# Altium project MainBoard.PrjPCB (part 1 of 2)
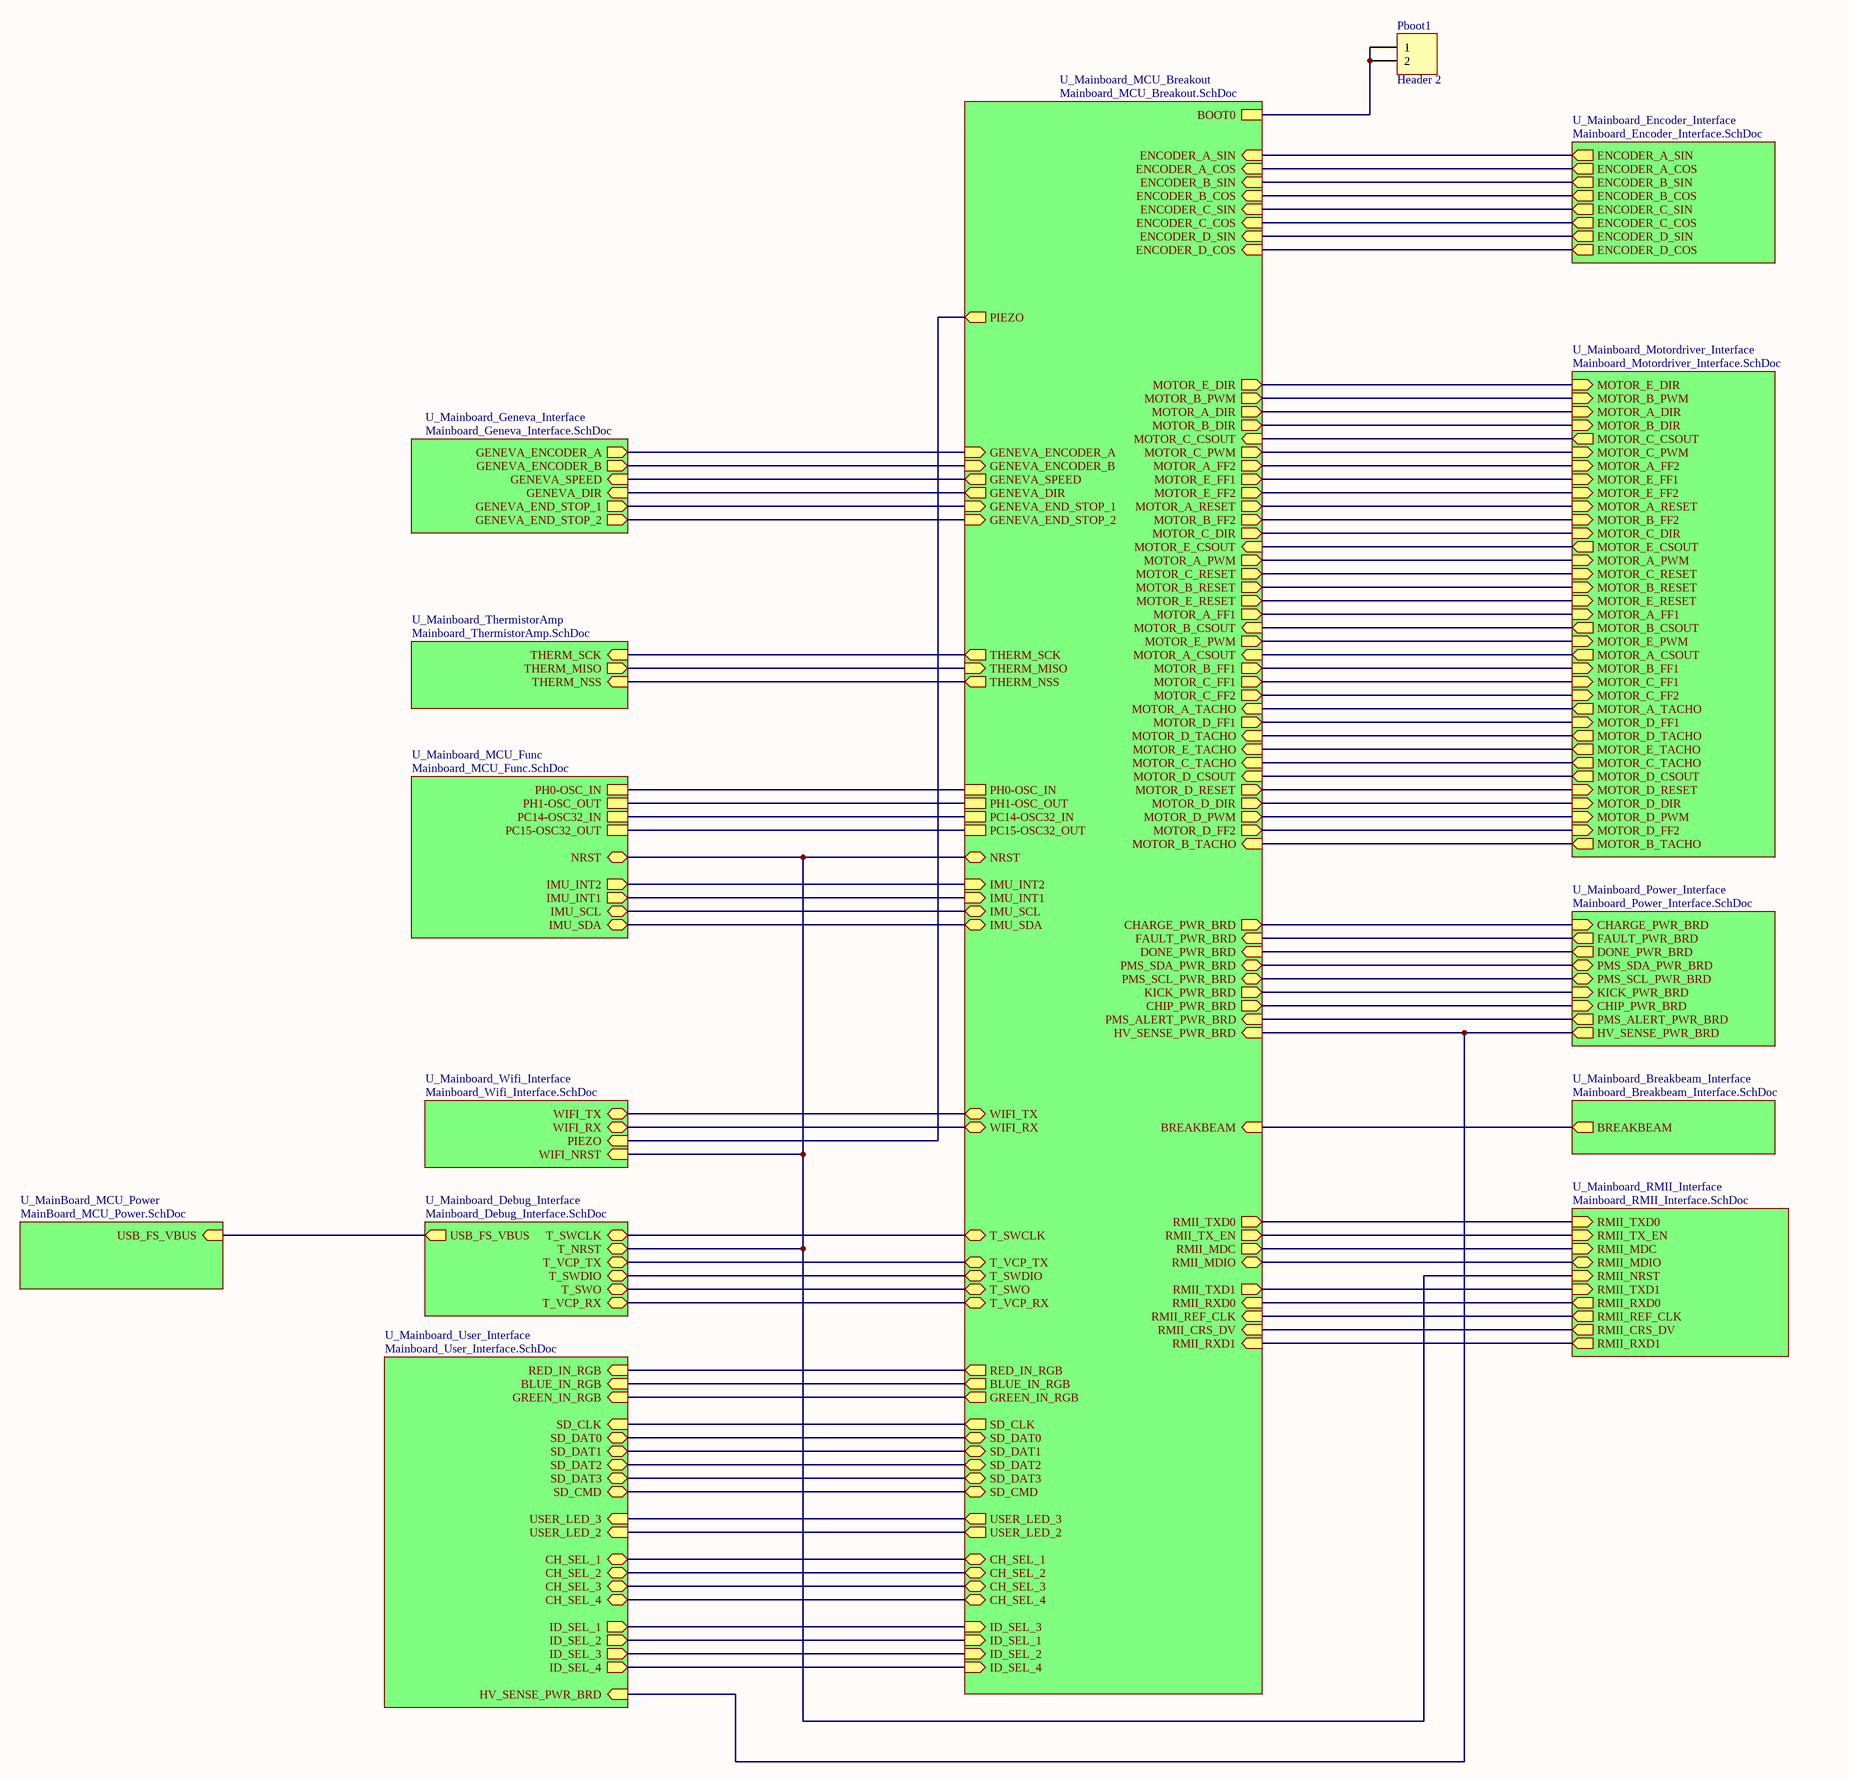
[diagram p0: MainBoard_Top.SchDoc]
14 sheets, 239 parts. Net scope: hierarchical (ports join the sheet entries above them; power ports are global).
Board file: MainBoard_Layout_V2.PcbDoc
Sheets:
  MainBoard_Top.SchDoc
    U_Mainboard_Encoder_Interface = Mainboard_Encoder_Interface.SchDoc
    U_Mainboard_Motordriver_Interface = Mainboard_Motordriver_Interface.SchDoc
    U_Mainboard_Power_Interface = Mainboard_Power_Interface.SchDoc
    U_Mainboard_RMII_Interface = Mainboard_RMII_Interface.SchDoc
    U_Mainboard_Wifi_Interface = Mainboard_Wifi_Interface.SchDoc
    U_Mainboard_Breakbeam_Interface = Mainboard_Breakbeam_Interface.SchDoc
    U_MainBoard_MCU_Power = MainBoard_MCU_Power.SchDoc
    U_Mainboard_Debug_Interface = Mainboard_Debug_Interface.SchDoc
    U_Mainboard_MCU_Breakout = Mainboard_MCU_Breakout.SchDoc
    U_Mainboard_MCU_Func = Mainboard_MCU_Func.SchDoc
    U_Mainboard_ThermistorAmp = Mainboard_ThermistorAmp.SchDoc
    U_Mainboard_User_Interface = Mainboard_User_Interface.SchDoc
    U_Mainboard_Geneva_Interface = Mainboard_Geneva_Interface.SchDoc

## Sheet MainBoard_Top.SchDoc
size C

### Parts
Pboot1  Header 2  [HDR1X2]

### Sub-sheets
U_Mainboard_Breakbeam_Interface = Mainboard_Breakbeam_Interface.SchDoc: BREAKBEAM (out)
U_Mainboard_Debug_Interface = Mainboard_Debug_Interface.SchDoc: USB_FS_VBUS (out), T_SWCLK (bidir), T_NRST (bidir), T_VCP_TX (bidir), T_SWDIO (bidir), T_SWO (bidir), T_VCP_RX (bidir)
U_Mainboard_Encoder_Interface = Mainboard_Encoder_Interface.SchDoc: ENCODER_A_SIN (out), ENCODER_B_COS (out), ENCODER_C_COS (out), ENCODER_A_COS (out), ENCODER_D_SIN (out), ENCODER_D_COS (out), ENCODER_B_SIN (out), ENCODER_C_SIN (out)
U_Mainboard_Geneva_Interface = Mainboard_Geneva_Interface.SchDoc: GENEVA_SPEED (in), GENEVA_ENCODER_A (out), GENEVA_ENCODER_B (out), GENEVA_DIR (in), GENEVA_END_STOP_1 (out), GENEVA_END_STOP_2 (out)
U_Mainboard_MCU_Breakout = Mainboard_MCU_Breakout.SchDoc: BOOT0, T_SWCLK (bidir), T_VCP_TX (bidir), T_SWDIO (bidir), T_SWO (bidir), T_VCP_RX (bidir), RED_IN_RGB (out), BLUE_IN_RGB (out), GREEN_IN_RGB (out), SD_CLK (out), SD_DAT0 (bidir), SD_DAT1 (bidir), SD_DAT2 (bidir), SD_DAT3 (bidir), SD_CMD (bidir), CH_SEL_1 (bidir), CH_SEL_2 (bidir), CH_SEL_3 (bidir), CH_SEL_4 (bidir), ENCODER_A_SIN (in), ENCODER_A_COS (in), ENCODER_B_SIN (in), ENCODER_B_COS (in), ENCODER_C_SIN (in), ENCODER_C_COS (in), ENCODER_D_SIN (in), ENCODER_D_COS (in), USER_LED_3 (out), USER_LED_2 (out), PC15-OSC32_OUT, PC14-OSC32_IN, PH1-OSC_OUT, NRST (bidir), PH0-OSC_IN, IMU_INT2 (in), IMU_INT1 (in), BREAKBEAM (in), RMII_TXD0 (out), RMII_TX_EN (out), RMII_MDC (out), RMII_MDIO (bidir), RMII_TXD1 (out), RMII_RXD0 (in), RMII_REF_CLK (in), RMII_CRS_DV (in), RMII_RXD1 (in), HV_SENSE_PWR_BRD (in), PMS_ALERT_PWR_BRD (in), CHIP_PWR_BRD (out), KICK_PWR_BRD (out), PMS_SCL_PWR_BRD (bidir), PMS_SDA_PWR_BRD (bidir), DONE_PWR_BRD (in), FAULT_PWR_BRD (in), CHARGE_PWR_BRD (out), IMU_SDA (bidir), IMU_SCL (bidir), THERM_NSS (out), THERM_MISO (in), THERM_SCK (out), WIFI_RX (bidir), WIFI_TX (bidir), ID_SEL_3 (in), ID_SEL_1 (in), ID_SEL_2 (in), ID_SEL_4 (in), MOTOR_E_DIR (out), MOTOR_B_PWM (out), MOTOR_A_DIR (out), MOTOR_B_DIR (out), MOTOR_C_CSOUT (in), MOTOR_C_PWM (out), MOTOR_A_FF2 (out), MOTOR_E_FF1 (out), MOTOR_E_FF2 (out), MOTOR_A_RESET (out), MOTOR_B_FF2 (out), MOTOR_C_DIR (out), MOTOR_E_CSOUT (in), MOTOR_A_PWM (out), MOTOR_C_RESET (out), MOTOR_B_RESET (out), MOTOR_E_RESET (out), MOTOR_A_FF1 (out), MOTOR_B_CSOUT (in), MOTOR_E_PWM (out), MOTOR_A_CSOUT (in), MOTOR_B_FF1 (out), MOTOR_C_FF1 (out), MOTOR_C_FF2 (out), MOTOR_A_TACHO (in), MOTOR_D_FF1 (out), MOTOR_D_TACHO (in), MOTOR_E_TACHO (in), MOTOR_C_TACHO (in), MOTOR_D_CSOUT (in), MOTOR_D_RESET (out), MOTOR_D_DIR (out), MOTOR_D_PWM (out), MOTOR_D_FF2 (out), MOTOR_B_TACHO (in), GENEVA_ENCODER_B (in), GENEVA_ENCODER_A (in), GENEVA_SPEED (out), PIEZO (out), GENEVA_DIR (out), GENEVA_END_STOP_2 (in), GENEVA_END_STOP_1 (in)
U_Mainboard_MCU_Func = Mainboard_MCU_Func.SchDoc: NRST (bidir), IMU_SCL (bidir), IMU_SDA (bidir), IMU_INT1 (out), IMU_INT2 (out), PH0-OSC_IN, PH1-OSC_OUT, PC14-OSC32_IN, PC15-OSC32_OUT
U_MainBoard_MCU_Power = MainBoard_MCU_Power.SchDoc: USB_FS_VBUS (in)
U_Mainboard_Motordriver_Interface = Mainboard_Motordriver_Interface.SchDoc: MOTOR_E_DIR (in), MOTOR_B_PWM (in), MOTOR_A_DIR (in), MOTOR_B_DIR (in), MOTOR_C_CSOUT (out), MOTOR_C_PWM (in), MOTOR_A_FF2 (in), MOTOR_E_FF1 (in), MOTOR_E_FF2 (in), MOTOR_A_RESET (in), MOTOR_B_FF2 (in), MOTOR_C_DIR (in), MOTOR_E_CSOUT (out), MOTOR_A_PWM (in), MOTOR_C_RESET (in), MOTOR_B_RESET (in), MOTOR_E_RESET (in), MOTOR_A_FF1 (in), MOTOR_B_CSOUT (out), MOTOR_E_PWM (in), MOTOR_A_CSOUT (out), MOTOR_B_FF1 (in), MOTOR_C_FF1 (in), MOTOR_C_FF2 (in), MOTOR_A_TACHO (out), MOTOR_D_FF1 (in), MOTOR_D_TACHO (out), MOTOR_E_TACHO (out), MOTOR_C_TACHO (out), MOTOR_D_CSOUT (out), MOTOR_D_RESET (in), MOTOR_D_DIR (in), MOTOR_D_PWM (in), MOTOR_D_FF2 (in), MOTOR_B_TACHO (out)
U_Mainboard_Power_Interface = Mainboard_Power_Interface.SchDoc: CHARGE_PWR_BRD (in), FAULT_PWR_BRD (out), DONE_PWR_BRD (out), PMS_SDA_PWR_BRD (bidir), PMS_SCL_PWR_BRD (bidir), KICK_PWR_BRD (in), CHIP_PWR_BRD (in), PMS_ALERT_PWR_BRD (out), HV_SENSE_PWR_BRD (out)
U_Mainboard_RMII_Interface = Mainboard_RMII_Interface.SchDoc: RMII_TXD0 (in), RMII_TX_EN (in), RMII_RXD0 (out), RMII_REF_CLK (out), RMII_CRS_DV (out), RMII_MDC (in), RMII_MDIO (bidir), RMII_NRST (in), RMII_TXD1 (in), RMII_RXD1 (out)
U_Mainboard_ThermistorAmp = Mainboard_ThermistorAmp.SchDoc: THERM_NSS (in), THERM_MISO (out), THERM_SCK (in)
U_Mainboard_User_Interface = Mainboard_User_Interface.SchDoc: RED_IN_RGB (in), BLUE_IN_RGB (in), GREEN_IN_RGB (in), SD_CLK (in), SD_DAT0 (bidir), SD_DAT1 (bidir), SD_DAT2 (bidir), SD_DAT3 (bidir), SD_CMD (bidir), USER_LED_3 (in), USER_LED_2 (in), CH_SEL_1 (bidir), CH_SEL_2 (bidir), CH_SEL_3 (bidir), CH_SEL_4 (bidir), ID_SEL_1 (out), ID_SEL_2 (out), ID_SEL_3 (out), ID_SEL_4 (out), HV_SENSE_PWR_BRD (in)
U_Mainboard_Wifi_Interface = Mainboard_Wifi_Interface.SchDoc: WIFI_NRST (in), WIFI_TX (bidir), WIFI_RX (bidir), PIEZO (in)

### Nets
COS_A: sheet U_Mainboard_Encoder_Interface/ENCODER_A_COS, sheet U_Mainboard_MCU_Breakout/ENCODER_A_COS
COS_B: sheet U_Mainboard_Encoder_Interface/ENCODER_B_COS, sheet U_Mainboard_MCU_Breakout/ENCODER_B_COS
COS_C: sheet U_Mainboard_Encoder_Interface/ENCODER_C_COS, sheet U_Mainboard_MCU_Breakout/ENCODER_C_COS
COS_D: sheet U_Mainboard_Encoder_Interface/ENCODER_D_COS, sheet U_Mainboard_MCU_Breakout/ENCODER_D_COS
GEN_DIR: sheet U_Mainboard_MCU_Breakout/GENEVA_DIR, sheet U_Mainboard_Geneva_Interface/GENEVA_DIR
GEN_ES1: sheet U_Mainboard_MCU_Breakout/GENEVA_END_STOP_1, sheet U_Mainboard_Geneva_Interface/GENEVA_END_STOP_1
GEN_ES2: sheet U_Mainboard_MCU_Breakout/GENEVA_END_STOP_2, sheet U_Mainboard_Geneva_Interface/GENEVA_END_STOP_2
GEN_SPD: sheet U_Mainboard_MCU_Breakout/GENEVA_SPEED, sheet U_Mainboard_Geneva_Interface/GENEVA_SPEED
GENENC_A: sheet U_Mainboard_MCU_Breakout/GENEVA_ENCODER_A, sheet U_Mainboard_Geneva_Interface/GENEVA_ENCODER_A
GENENC_B: sheet U_Mainboard_MCU_Breakout/GENEVA_ENCODER_B, sheet U_Mainboard_Geneva_Interface/GENEVA_ENCODER_B
PC14-OSC32_IN: sheet U_Mainboard_MCU_Breakout/PC14-OSC32_IN, sheet U_Mainboard_MCU_Func/PC14-OSC32_IN
PC15-OSC32_OUT: sheet U_Mainboard_MCU_Breakout/PC15-OSC32_OUT, sheet U_Mainboard_MCU_Func/PC15-OSC32_OUT
PH0-OSC_IN: sheet U_Mainboard_MCU_Breakout/PH0-OSC_IN, sheet U_Mainboard_MCU_Func/PH0-OSC_IN
PH1-OSC_OUT: sheet U_Mainboard_MCU_Breakout/PH1-OSC_OUT, sheet U_Mainboard_MCU_Func/PH1-OSC_OUT
RMII_MDIO: sheet U_Mainboard_RMII_Interface/RMII_MDIO, sheet U_Mainboard_MCU_Breakout/RMII_MDIO
RMII_REF_CLK: sheet U_Mainboard_RMII_Interface/RMII_REF_CLK, sheet U_Mainboard_MCU_Breakout/RMII_REF_CLK
RMII_TX_EN: sheet U_Mainboard_RMII_Interface/RMII_TX_EN, sheet U_Mainboard_MCU_Breakout/RMII_TX_EN
RMII_TXD0: sheet U_Mainboard_RMII_Interface/RMII_TXD0, sheet U_Mainboard_MCU_Breakout/RMII_TXD0
RMII_TXD1: sheet U_Mainboard_RMII_Interface/RMII_TXD1, sheet U_Mainboard_MCU_Breakout/RMII_TXD1
SIN_A: sheet U_Mainboard_Encoder_Interface/ENCODER_A_SIN, sheet U_Mainboard_MCU_Breakout/ENCODER_A_SIN
SIN_B: sheet U_Mainboard_Encoder_Interface/ENCODER_B_SIN, sheet U_Mainboard_MCU_Breakout/ENCODER_B_SIN
SIN_C: sheet U_Mainboard_Encoder_Interface/ENCODER_C_SIN, sheet U_Mainboard_MCU_Breakout/ENCODER_C_SIN
SIN_D: sheet U_Mainboard_Encoder_Interface/ENCODER_D_SIN, sheet U_Mainboard_MCU_Breakout/ENCODER_D_SIN
NetC70_2: sheet U_Mainboard_RMII_Interface/RMII_NRST, sheet U_Mainboard_Wifi_Interface/WIFI_NRST, sheet U_Mainboard_Debug_Interface/T_NRST, sheet U_Mainboard_MCU_Breakout/NRST, sheet U_Mainboard_MCU_Func/NRST
NetD4_1: sheet U_Mainboard_Wifi_Interface/PIEZO, sheet U_Mainboard_MCU_Breakout/PIEZO
NetF1_1: sheet U_MainBoard_MCU_Power/USB_FS_VBUS, sheet U_Mainboard_Debug_Interface/USB_FS_VBUS
NetJ6_21: sheet U_Mainboard_Power_Interface/CHARGE_PWR_BRD, sheet U_Mainboard_MCU_Breakout/CHARGE_PWR_BRD
NetJ6_22: sheet U_Mainboard_Power_Interface/KICK_PWR_BRD, sheet U_Mainboard_MCU_Breakout/KICK_PWR_BRD
NetJ6_23: sheet U_Mainboard_Power_Interface/FAULT_PWR_BRD, sheet U_Mainboard_MCU_Breakout/FAULT_PWR_BRD
NetJ6_24: sheet U_Mainboard_Power_Interface/CHIP_PWR_BRD, sheet U_Mainboard_MCU_Breakout/CHIP_PWR_BRD
NetJ6_25: sheet U_Mainboard_Power_Interface/DONE_PWR_BRD, sheet U_Mainboard_MCU_Breakout/DONE_PWR_BRD
NetJ6_26: sheet U_Mainboard_Power_Interface/PMS_ALERT_PWR_BRD, sheet U_Mainboard_MCU_Breakout/PMS_ALERT_PWR_BRD
NetJ6_27: sheet U_Mainboard_Power_Interface/PMS_SDA_PWR_BRD, sheet U_Mainboard_MCU_Breakout/PMS_SDA_PWR_BRD
NetJ6_29: sheet U_Mainboard_Power_Interface/PMS_SCL_PWR_BRD, sheet U_Mainboard_MCU_Breakout/PMS_SCL_PWR_BRD
NetJ6_34: sheet U_Mainboard_Power_Interface/HV_SENSE_PWR_BRD, sheet U_Mainboard_MCU_Breakout/HV_SENSE_PWR_BRD, sheet U_Mainboard_User_Interface/HV_SENSE_PWR_BRD
NetJ7_A12: sheet U_Mainboard_Motordriver_Interface/MOTOR_A_CSOUT, sheet U_Mainboard_MCU_Breakout/MOTOR_A_CSOUT
NetJ7_A14: sheet U_Mainboard_Motordriver_Interface/MOTOR_A_PWM, sheet U_Mainboard_MCU_Breakout/MOTOR_A_PWM
NetJ7_A15: sheet U_Mainboard_Motordriver_Interface/MOTOR_A_DIR, sheet U_Mainboard_MCU_Breakout/MOTOR_A_DIR
NetJ7_A16: sheet U_Mainboard_Motordriver_Interface/MOTOR_A_TACHO, sheet U_Mainboard_MCU_Breakout/MOTOR_A_TACHO
NetJ7_B16: sheet U_Mainboard_Motordriver_Interface/MOTOR_A_FF1, sheet U_Mainboard_MCU_Breakout/MOTOR_A_FF1
NetJ7_B17: sheet U_Mainboard_Motordriver_Interface/MOTOR_A_FF2, sheet U_Mainboard_MCU_Breakout/MOTOR_A_FF2
NetJ7_B18: sheet U_Mainboard_Motordriver_Interface/MOTOR_A_RESET, sheet U_Mainboard_MCU_Breakout/MOTOR_A_RESET
NetJ8_A12: sheet U_Mainboard_Motordriver_Interface/MOTOR_C_CSOUT, sheet U_Mainboard_MCU_Breakout/MOTOR_C_CSOUT
NetJ8_A14: sheet U_Mainboard_Motordriver_Interface/MOTOR_C_PWM, sheet U_Mainboard_MCU_Breakout/MOTOR_C_PWM
NetJ8_A15: sheet U_Mainboard_Motordriver_Interface/MOTOR_C_DIR, sheet U_Mainboard_MCU_Breakout/MOTOR_C_DIR
NetJ8_A16: sheet U_Mainboard_Motordriver_Interface/MOTOR_C_TACHO, sheet U_Mainboard_MCU_Breakout/MOTOR_C_TACHO
NetJ8_B16: sheet U_Mainboard_Motordriver_Interface/MOTOR_C_FF1, sheet U_Mainboard_MCU_Breakout/MOTOR_C_FF1
NetJ8_B17: sheet U_Mainboard_Motordriver_Interface/MOTOR_C_FF2, sheet U_Mainboard_MCU_Breakout/MOTOR_C_FF2
NetJ8_B18: sheet U_Mainboard_Motordriver_Interface/MOTOR_C_RESET, sheet U_Mainboard_MCU_Breakout/MOTOR_C_RESET
NetJ9_A12: sheet U_Mainboard_Motordriver_Interface/MOTOR_E_CSOUT, sheet U_Mainboard_MCU_Breakout/MOTOR_E_CSOUT
NetJ9_A14: sheet U_Mainboard_Motordriver_Interface/MOTOR_E_PWM, sheet U_Mainboard_MCU_Breakout/MOTOR_E_PWM
NetJ9_A15: sheet U_Mainboard_Motordriver_Interface/MOTOR_E_DIR, sheet U_Mainboard_MCU_Breakout/MOTOR_E_DIR
NetJ9_A16: sheet U_Mainboard_Motordriver_Interface/MOTOR_E_TACHO, sheet U_Mainboard_MCU_Breakout/MOTOR_E_TACHO
NetJ9_B16: sheet U_Mainboard_Motordriver_Interface/MOTOR_E_FF1, sheet U_Mainboard_MCU_Breakout/MOTOR_E_FF1
NetJ9_B17: sheet U_Mainboard_Motordriver_Interface/MOTOR_E_FF2, sheet U_Mainboard_MCU_Breakout/MOTOR_E_FF2
NetJ9_B18: sheet U_Mainboard_Motordriver_Interface/MOTOR_E_RESET, sheet U_Mainboard_MCU_Breakout/MOTOR_E_RESET
NetJ10_A12: sheet U_Mainboard_Motordriver_Interface/MOTOR_B_CSOUT, sheet U_Mainboard_MCU_Breakout/MOTOR_B_CSOUT
NetJ10_A14: sheet U_Mainboard_Motordriver_Interface/MOTOR_B_PWM, sheet U_Mainboard_MCU_Breakout/MOTOR_B_PWM
NetJ10_A15: sheet U_Mainboard_Motordriver_Interface/MOTOR_B_DIR, sheet U_Mainboard_MCU_Breakout/MOTOR_B_DIR
NetJ10_A16: sheet U_Mainboard_Motordriver_Interface/MOTOR_B_TACHO, sheet U_Mainboard_MCU_Breakout/MOTOR_B_TACHO
NetJ10_B16: sheet U_Mainboard_Motordriver_Interface/MOTOR_B_FF1, sheet U_Mainboard_MCU_Breakout/MOTOR_B_FF1
NetJ10_B17: sheet U_Mainboard_Motordriver_Interface/MOTOR_B_FF2, sheet U_Mainboard_MCU_Breakout/MOTOR_B_FF2
NetJ10_B18: sheet U_Mainboard_Motordriver_Interface/MOTOR_B_RESET, sheet U_Mainboard_MCU_Breakout/MOTOR_B_RESET
NetJ11_A12: sheet U_Mainboard_Motordriver_Interface/MOTOR_D_CSOUT, sheet U_Mainboard_MCU_Breakout/MOTOR_D_CSOUT
NetJ11_A14: sheet U_Mainboard_Motordriver_Interface/MOTOR_D_PWM, sheet U_Mainboard_MCU_Breakout/MOTOR_D_PWM
NetJ11_A15: sheet U_Mainboard_Motordriver_Interface/MOTOR_D_DIR, sheet U_Mainboard_MCU_Breakout/MOTOR_D_DIR
NetJ11_A16: sheet U_Mainboard_Motordriver_Interface/MOTOR_D_TACHO, sheet U_Mainboard_MCU_Breakout/MOTOR_D_TACHO
NetJ11_B16: sheet U_Mainboard_Motordriver_Interface/MOTOR_D_FF1, sheet U_Mainboard_MCU_Breakout/MOTOR_D_FF1
NetJ11_B17: sheet U_Mainboard_Motordriver_Interface/MOTOR_D_FF2, sheet U_Mainboard_MCU_Breakout/MOTOR_D_FF2
NetJ11_B18: sheet U_Mainboard_Motordriver_Interface/MOTOR_D_RESET, sheet U_Mainboard_MCU_Breakout/MOTOR_D_RESET
NetJ12_2: sheet U_Mainboard_Wifi_Interface/WIFI_RX, sheet U_Mainboard_MCU_Breakout/WIFI_RX
NetJ12_3: sheet U_Mainboard_Wifi_Interface/WIFI_TX, sheet U_Mainboard_MCU_Breakout/WIFI_TX
NetJ13_2: sheet U_Mainboard_Breakbeam_Interface/BREAKBEAM, sheet U_Mainboard_MCU_Breakout/BREAKBEAM
NetJ14_1: sheet U_Mainboard_MCU_Breakout/SD_DAT2, sheet U_Mainboard_User_Interface/SD_DAT2
NetJ14_2: sheet U_Mainboard_MCU_Breakout/SD_DAT3, sheet U_Mainboard_User_Interface/SD_DAT3
NetJ14_3: sheet U_Mainboard_MCU_Breakout/SD_CMD, sheet U_Mainboard_User_Interface/SD_CMD
NetJ14_5: sheet U_Mainboard_MCU_Breakout/SD_CLK, sheet U_Mainboard_User_Interface/SD_CLK
NetJ14_7: sheet U_Mainboard_MCU_Breakout/SD_DAT0, sheet U_Mainboard_User_Interface/SD_DAT0
NetJ14_8: sheet U_Mainboard_MCU_Breakout/SD_DAT1, sheet U_Mainboard_User_Interface/SD_DAT1
NetPboot1_1: Pboot1.1 Pboot1.2 ; sheet U_Mainboard_MCU_Breakout/BOOT0
NetR63_2: sheet U_Mainboard_RMII_Interface/RMII_RXD0, sheet U_Mainboard_MCU_Breakout/RMII_RXD0
NetR64_2: sheet U_Mainboard_RMII_Interface/RMII_RXD1, sheet U_Mainboard_MCU_Breakout/RMII_RXD1
NetR66_2: sheet U_Mainboard_RMII_Interface/RMII_CRS_DV, sheet U_Mainboard_MCU_Breakout/RMII_CRS_DV
NetR85_2: sheet U_Mainboard_MCU_Breakout/USER_LED_2, sheet U_Mainboard_User_Interface/USER_LED_2
NetR88_1: sheet U_Mainboard_MCU_Breakout/RED_IN_RGB, sheet U_Mainboard_User_Interface/RED_IN_RGB
NetR89_1: sheet U_Mainboard_MCU_Breakout/BLUE_IN_RGB, sheet U_Mainboard_User_Interface/BLUE_IN_RGB
NetR90_1: sheet U_Mainboard_MCU_Breakout/GREEN_IN_RGB, sheet U_Mainboard_User_Interface/GREEN_IN_RGB
NetR92_2: sheet U_Mainboard_MCU_Breakout/USER_LED_3, sheet U_Mainboard_User_Interface/USER_LED_3
NetR98_1: sheet U_Mainboard_MCU_Breakout/THERM_SCK, sheet U_Mainboard_ThermistorAmp/THERM_SCK
NetR99_1: sheet U_Mainboard_MCU_Breakout/THERM_MISO, sheet U_Mainboard_ThermistorAmp/THERM_MISO
NetR100_1: sheet U_Mainboard_MCU_Breakout/THERM_NSS, sheet U_Mainboard_ThermistorAmp/THERM_NSS
NetS2_1A: sheet U_Mainboard_MCU_Breakout/CH_SEL_1, sheet U_Mainboard_User_Interface/CH_SEL_1
NetS2_2A: sheet U_Mainboard_MCU_Breakout/CH_SEL_2, sheet U_Mainboard_User_Interface/CH_SEL_2
NetS2_3A: sheet U_Mainboard_MCU_Breakout/CH_SEL_3, sheet U_Mainboard_User_Interface/CH_SEL_3
NetS2_4A: sheet U_Mainboard_MCU_Breakout/CH_SEL_4, sheet U_Mainboard_User_Interface/CH_SEL_4
NetS3_1A: sheet U_Mainboard_MCU_Breakout/ID_SEL_3, sheet U_Mainboard_User_Interface/ID_SEL_1
NetS3_2A: sheet U_Mainboard_MCU_Breakout/ID_SEL_1, sheet U_Mainboard_User_Interface/ID_SEL_2
NetS3_3A: sheet U_Mainboard_MCU_Breakout/ID_SEL_2, sheet U_Mainboard_User_Interface/ID_SEL_3
NetS3_4A: sheet U_Mainboard_MCU_Breakout/ID_SEL_4, sheet U_Mainboard_User_Interface/ID_SEL_4
NetU9_13: sheet U_Mainboard_RMII_Interface/RMII_MDC, sheet U_Mainboard_MCU_Breakout/RMII_MDC
NetU10_4: sheet U_Mainboard_MCU_Breakout/IMU_INT1, sheet U_Mainboard_MCU_Func/IMU_INT1
NetU10_9: sheet U_Mainboard_MCU_Breakout/IMU_INT2, sheet U_Mainboard_MCU_Func/IMU_INT2
NetU10_13: sheet U_Mainboard_MCU_Breakout/IMU_SCL, sheet U_Mainboard_MCU_Func/IMU_SCL
NetU10_14: sheet U_Mainboard_MCU_Breakout/IMU_SDA, sheet U_Mainboard_MCU_Func/IMU_SDA
NetU11_4: sheet U_Mainboard_Debug_Interface/T_SWDIO, sheet U_Mainboard_MCU_Breakout/T_SWDIO
NetU11_6: sheet U_Mainboard_Debug_Interface/T_SWO, sheet U_Mainboard_MCU_Breakout/T_SWO
NetU11_12: sheet U_Mainboard_Debug_Interface/T_VCP_TX, sheet U_Mainboard_MCU_Breakout/T_VCP_TX
NetU11_13: sheet U_Mainboard_Debug_Interface/T_SWCLK, sheet U_Mainboard_MCU_Breakout/T_SWCLK
NetU11_15: sheet U_Mainboard_Debug_Interface/T_VCP_RX, sheet U_Mainboard_MCU_Breakout/T_VCP_RX

### Library data of the parts
Pboot1 = Header 2: Header, 2-Pin; LatestRevisionDate: 17-Jul-2002; LatestRevisionNote: Re-released for DXP Platform.; Publisher: Altium Limited

## Sheet Mainboard_Encoder_Interface.SchDoc
size 381 x 254 mm
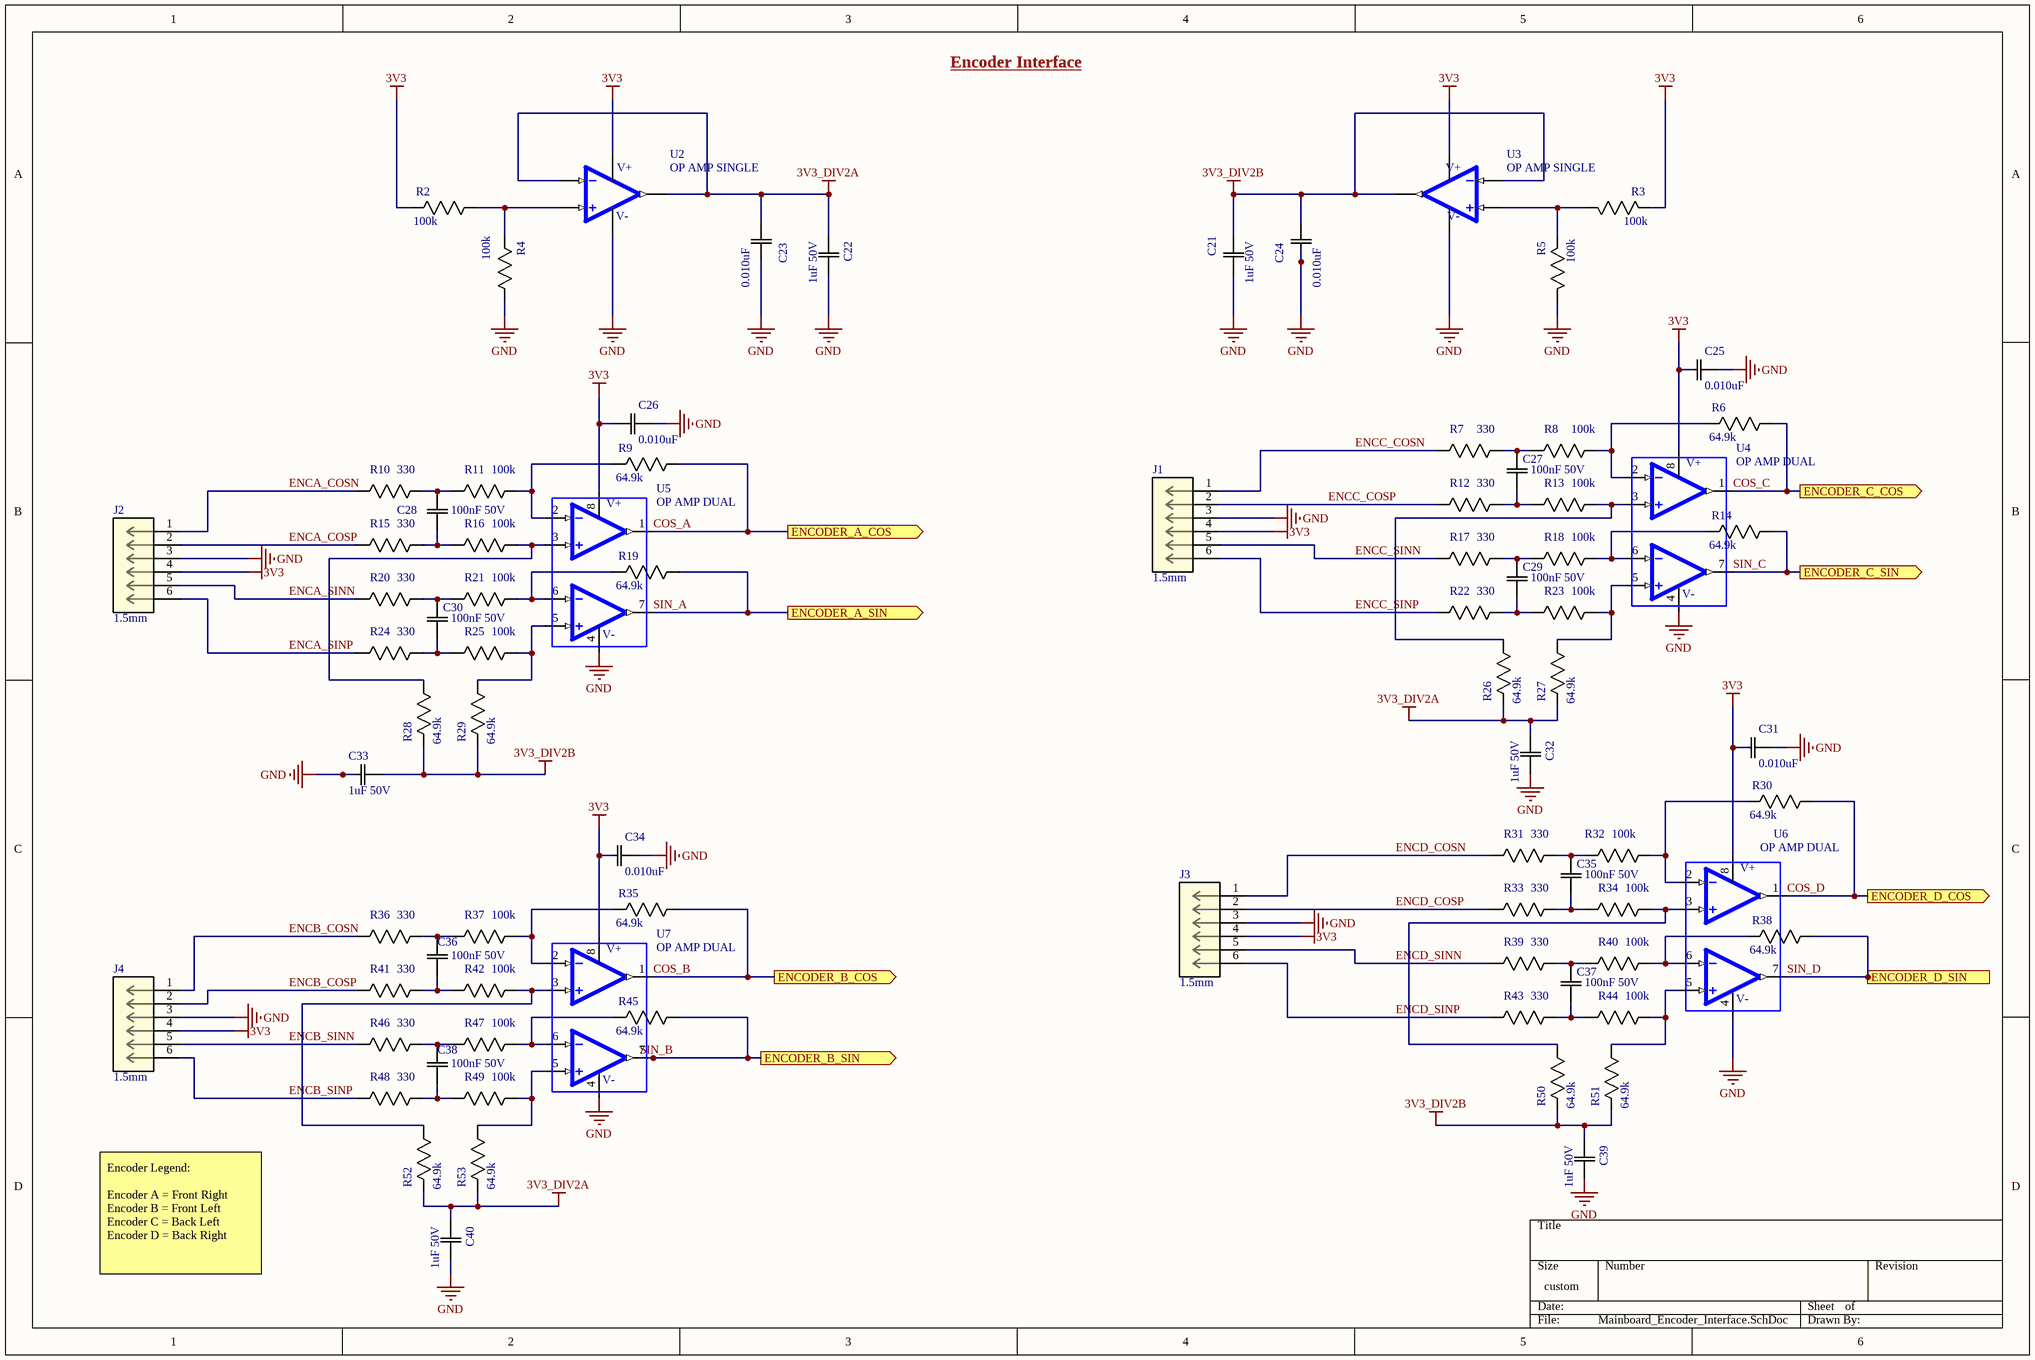
[diagram p1: Mainboard_Encoder_Interface.SchDoc]

### Parts
C21  1uF 50V  [0805]
C22  1uF 50V  [0805]
C23  0.010uF  [0805]
C24  0.010uF  [0805]
C25  0.010uF  [0805]
C26  0.010uF  [0805]
C27  100nF 50V  [0805]
C28  100nF 50V  [0805]
C29  100nF 50V  [0805]
C30  100nF 50V  [0805]
C31  0.010uF  [0805]
C32  1uF 50V  [0805]
C33  1uF 50V  [0805]
C34  0.010uF  [0805]
C35  100nF 50V  [0805]
C36  100nF 50V  [0805]
C37  100nF 50V  [0805]
C38  100nF 50V  [0805]
C39  1uF 50V  [0805]
C40  1uF 50V  [0805]
J1  1.5mm  [6POS JST]
J2  1.5mm  [6POS JST]
J3  1.5mm  [6POS JST]
J4  1.5mm  [6POS JST]
R2  100k  [0805]
R3  100k  [0805]
R4  100k  [0805]
R5  100k  [0805]
R6  64.9k  [0805]
R7  330  [0805]
R8  100k  [0805]
R9  64.9k  [0805]
R10  330  [0805]
R11  100k  [0805]
R12  330  [0805]
R13  100k  [0805]
R14  64.9k  [0805]
R15  330  [0805]
R16  100k  [0805]
R17  330  [0805]
R18  100k  [0805]
R19  64.9k  [0805]
R20  330  [0805]
R21  100k  [0805]
R22  330  [0805]
R23  100k  [0805]
R24  330  [0805]
R25  100k  [0805]
R26  64.9k  [0805]
R27  64.9k  [0805]
R28  64.9k  [0805]
R29  64.9k  [0805]
R30  64.9k  [0805]
R31  330  [0805]
R32  100k  [0805]
R33  330  [0805]
R34  100k  [0805]
R35  64.9k  [0805]
R36  330  [0805]
R37  100k  [0805]
R38  64.9k  [0805]
R39  330  [0805]
R40  100k  [0805]
R41  330  [0805]
R42  100k  [0805]
R43  330  [0805]
R44  100k  [0805]
R45  64.9k  [0805]
R46  330  [0805]
R47  100k  [0805]
R48  330  [0805]
R49  100k  [0805]
R50  64.9k  [0805]
R51  64.9k  [0805]
R52  64.9k  [0805]
R53  64.9k  [0805]
U2  OP AMP SINGLE  [SOT95P280X145-5N]
U3  OP AMP SINGLE  [SOT95P280X145-5N]
U4  OP AMP DUAL  [8-MSOP]
U5  OP AMP DUAL  [8-MSOP]
U6  OP AMP DUAL  [8-MSOP]
U7  OP AMP DUAL  [8-MSOP]

### Ports
ENCODER_A_COS (out), ENCODER_A_SIN (out), ENCODER_B_COS (out), ENCODER_B_SIN (out), ENCODER_C_COS (out), ENCODER_C_SIN (out), ENCODER_D_COS (out), ENCODER_D_SIN (out)

### Nets
3V3: C25.1(C1) C26.1(C1) C31.1(C1) C34.1(C1) J1.4 J2.4 J3.4 J4.4 R2.2(R2) R3.2(R2) U2.5(V+) U3.5(V+) U4.8(V+) U5.8(V+) U6.8(V+) U7.8(V+)
3V3_DIV2A: C22.1(C1) C23.1(C1) C32.1(C1) C40.1(C1) R26.2(R2) R27.2(R2) R52.2(R2) R53.2(R2) U2.1(OUT) U2.4(IN-)
3V3_DIV2B: C21.1(C1) C24.1(C1) C33.2(C2) C39.1(C1) R28.2(R2) R29.2(R2) R50.2(R2) R51.2(R2) U3.1(OUT) U3.4(IN-)
GND: C21.2(C2) C22.2(C2) C23.2(C2) C24.2(C2) C25.2(C2) C26.2(C2) C31.2(C2) C32.2(C2) C33.1(C1) C34.2(C2) C39.2(C2) C40.2(C2) J1.3 J2.3 J3.3 J4.3 R4.1(R1) R5.1(R1) U2.2(V-) U3.2(V-) U4.4(V-) U5.4(V-) U6.4(V-) U7.4(V-)
COS_A: R9.1(R1) U5.1(OUTA) ; port ENCODER_A_COS
COS_B: R35.1(R1) U7.1(OUTA) ; port ENCODER_B_COS
COS_C: R6.1(R1) U4.1(OUTA) ; port ENCODER_C_COS
COS_D: R30.1(R1) U6.1(OUTA) ; port ENCODER_D_COS
ENCA_COSN: J2.1 R10.2(R2)
ENCA_COSP: J2.2 R15.2(R2)
ENCA_SINN: J2.5 R20.2(R2)
ENCA_SINP: J2.6 R24.2(R2)
ENCB_COSN: J4.1 R36.2(R2)
ENCB_COSP: J4.2 R41.2(R2)
ENCB_SINN: J4.5 R46.2(R2)
ENCB_SINP: J4.6 R48.2(R2)
ENCC_COSN: J1.1 R7.2(R2)
ENCC_COSP: J1.2 R12.2(R2)
ENCC_SINN: J1.5 R17.2(R2)
ENCC_SINP: J1.6 R22.2(R2)
ENCD_COSN: J3.1 R31.2(R2)
ENCD_COSP: J3.2 R33.2(R2)
ENCD_SINN: J3.5 R39.2(R2)
ENCD_SINP: J3.6 R43.2(R2)
SIN_A: R19.1(R1) U5.7(OUTB) ; port ENCODER_A_SIN
SIN_B: R45.1(R1) U7.7(OUTB) ; port ENCODER_B_SIN
SIN_C: R14.1(R1) U4.7(OUTB) ; port ENCODER_C_SIN
SIN_D: R38.1(R1) U6.7(OUTB) ; port ENCODER_D_SIN
NetC27_1: C27.1(C1) R7.1(R1) R8.2(R2)
NetC27_2: C27.2(C2) R12.1(R1) R13.2(R2)
NetC28_1: C28.1(C1) R10.1(R1) R11.2(R2)
NetC28_2: C28.2(C2) R15.1(R1) R16.2(R2)
NetC29_1: C29.1(C1) R17.1(R1) R18.2(R2)
NetC29_2: C29.2(C2) R22.1(R1) R23.2(R2)
NetC30_1: C30.1(C1) R20.1(R1) R21.2(R2)
NetC30_2: C30.2(C2) R24.1(R1) R25.2(R2)
NetC35_1: C35.1(C1) R31.1(R1) R32.2(R2)
NetC35_2: C35.2(C2) R33.1(R1) R34.2(R2)
NetC36_1: C36.1(C1) R36.1(R1) R37.2(R2)
NetC36_2: C36.2(C2) R41.1(R1) R42.2(R2)
NetC37_1: C37.1(C1) R39.1(R1) R40.2(R2)
NetC37_2: C37.2(C2) R43.1(R1) R44.2(R2)
NetC38_1: C38.1(C1) R46.1(R1) R47.2(R2)
NetC38_2: C38.2(C2) R48.1(R1) R49.2(R2)
NetR2_1: R2.1(R1) R4.2(R2) U2.3(IN+)
NetR3_1: R3.1(R1) R5.2(R2) U3.3(IN+)
NetR6_2: R6.2(R2) R8.1(R1) U4.2(INA-)
NetR9_2: R9.2(R2) R11.1(R1) U5.2(INA-)
NetR13_1: R13.1(R1) R26.1(R1) U4.3(INA+)
NetR14_2: R14.2(R2) R18.1(R1) U4.6(INB-)
NetR16_1: R16.1(R1) R28.1(R1) U5.3(INA+)
NetR19_2: R19.2(R2) R21.1(R1) U5.6(INB-)
NetR23_1: R23.1(R1) R27.1(R1) U4.5(INB+)
NetR25_1: R25.1(R1) R29.1(R1) U5.5(INB+)
NetR30_2: R30.2(R2) R32.1(R1) U6.2(INA-)
NetR34_1: R34.1(R1) R50.1(R1) U6.3(INA+)
NetR35_2: R35.2(R2) R37.1(R1) U7.2(INA-)
NetR38_2: R38.2(R2) R40.1(R1) U6.6(INB-)
NetR42_1: R42.1(R1) R52.1(R1) U7.3(INA+)
NetR44_1: R44.1(R1) R51.1(R1) U6.5(INB+)
NetR45_2: R45.2(R2) R47.1(R1) U7.6(INB-)
NetR49_1: R49.1(R1) R53.1(R1) U7.5(INB+)

### Notes on the sheet
- Encoder Interface
- Encoder Legend:
  Encoder A = Front Right
  Encoder B = Front Left
  Encoder C = Back Left
  Encoder D = Back Right

### Library data of the parts
C21 C22 C32 C33 C39 C40 = CAP 1uF 50V: CAP CER 1UF 50V X7R 0805; Tolerance: 10%; Package: 0805; Value: 1uF; Rating: 50V; Temperature Coefficient: X7R; Operating Temperature: -55°C ~ 125°C
C23-C26 C31 C34 = CAP 0.010uF 50V: CAP CER 0.010UF 50V X7R 0603/0805; Tolerance: 10%; Package: 0603/0805; Value: 0.010uF; Rating: 50V; Temperature Coefficient: X7R; Operating Temperature: -55°C ~ 125°C
C27-C30 C35-C38 = CAP 100nF 50V: CAP CER 0.1UF 50V X7R 0805; Tolerance: 10%; Package: 0805; Value: 100nF; Rating: 50V
J1-J4 = CN 6POS JST RA: Conn Shrouded Header HDR 6 POS 1.5mm Solder RA Thru-Hole Box; Manufacturer: JST; Manufacturer Part Number: S6B-ZR(LF)(SN); Body Plating: Tin; Number of Positions: 6; Current Rating: 1A; Connector Type: Header,Male Pin; Contact Resistance: 30mR; Voltage Rating: 50V; Gender: Male; Insulation Resistance: 500MR; Panel Thickness: 3.5mm; Supplier 1: Digi-Key; RoHS: Yes; Category: Headers and Wire Housings; Stock 1: 14808; Mount: Through Hole; Number of Pins: 6; Color: White; Contact Plating: Tin,Copper; Contact Material: Brass,Tin,Copper; Housing Color: Beige; Housing Material: Polyamide; Material: Nylon; Contact Shape: Circular; Insulation Material: Nylon; Insulation Color: Natural; Min Operating Temperature: -25°C; Max Operating Temperature: 85°C; Number of Rows: 1; Packaging: Bulk; Termination: Solder; Fastening Type: Detent; Number of Contacts: 6; Max Voltage Rating (AC): 50V; Max Current Rating: 1A; Orientation: Right Angle; Voltage Rating (AC): 50V; Voltage Rating (DC): 50V; Length: 10.5mm; Width: 3.5mm; Height: 7.2mm; Pitch: 1.5mm; Depth: 6mm; Lead Pitch: 1.5mm; Contact Mating Length: 0.094inch; Lead Free: Lead Free; Flammability Rating: UL94 V-0; REACH SVHC: No SVHC; ComponentLink1URL: https://datasheet.ciiva.com/8052/80556-8052225.pdf?src-supplier=Element14; ComponentLink1Description: https://datasheet.ciiva.com/8052/80556-8052225.pdf?src-supplier=Element14; ComponentLink2URL: https://datasheet.ciiva.com/25617/0900766b81147f94-25617345.pdf?src-supplier=RSComponents; ComponentLink2Description: https://datasheet.ciiva.com/25617/0900766b81147f94-25617345.pdf?src-supplier=RSComponents; ComponentLink3URL: https://datasheet.ciiva.com/11752/0900766b8082f593-11752194.pdf?src-supplier=RSComponents; ComponentLink3Description: https://datasheet.ciiva.com/11752/0900766b8082f593-11752194.pdf?src-supplier=RSComponents; ComponentLink4URL: https://datasheet.ciiva.com/26894/getdatasheetpartid-642095-26894637.pdf?src-supplier=Verical; ComponentLink4Description: https://datasheet.ciiva.com/26894/getdatasheetpartid-642095-26894637.pdf?src-supplier=Verical; ComponentLink5URL: https://datasheet.ciiva.com/712/ezh-712560.pdf?src-supplier=Digi-Key; ComponentLink5Description: https://datasheet.ciiva.com/712/ezh-712560.pdf?src-supplier=Digi-Key; ComponentLink6URL: https://datasheet.ciiva.com/16484/s6b-zrlfsn-16484554.pdf?src-supplier=Future+Electronics; ComponentLink6Description: https://datasheet.ciiva.com/16484/s6b-zrlfsn-16484554.pdf?src-supplier=Future+Electronics; Supplier Part Number 1: 455-1673-ND
R2-R5 R8 R11 R13 R16 R18 R21 R23 R25 R32 R34 R37 R40 R42 R44 R47 R49 = RES 100k 1/8W - 1%: RES SMD 100K OHM 1% 1/8W 0805; Power (Watts): 0.125W; Package: 0805; Value: 100k; Tolerance: 1%
R6 R9 R14 R19 R26-R30 R35 R38 R45 R50-R53 = RES 64.9k 1/8W: RES SMD 64.9K OHM 1% 1/8W 0805; Power (Watts): 0.125W; Package: 0805; Value: 64.9k; Tolerance: 1%; ComponentLink1Description: digikey; ComponentLink1URL: https://www.digikey.ca/en/products/detail/yageo/RC0805FR-0764K9L/728090
R7 R10 R12 R15 R17 R20 R22 R24 R31 R33 R36 R39 R41 R43 R46 R48 = RES 330.0 1/8W - 1%: RES SMD 330 OHM 1% 1/8W 0805; Rating: 0.125W; Package: 0805; Value: 330; Tolerance: 1%
U2 U3 = OP AMP SINGLE: ANALOG DEVICES - ADA4505-1ARJZ-R7 - IC, AMPLIF. OPER., R-R, CMOS, SOT23-5; Min Supply Voltage: 1.8V; Max Supply Voltage: 5V; Min Dual Supply Voltage: 900mV; Max Dual Supply Voltage: 2.5V; Voltage Gain: 120dB; Common Mode Rejection Ratio: 105dB; Gain Bandwidth Product: 50kHz; Slew Rate: 0.006V/µs; Operating Supply Voltage: 3V; Number of Circuits: 1; Input Bias Current: 500nA; Input Offset Voltage (Vos): 3mV; Operating Supply Current: 9uA; Output Current per Channel: 40mA; Power Supply Rejection Ratio (PSRR): 110dB; Input Capacitance: 4.7pF; Supplier 1: Digi-Key; Manufacturer: Analog Devices; Manufacturer Part Number: ADA4505-1ARJZ-R7; RoHS: Yes; Category: Amplifiers - Op Amps, Buffer, Instrumentation; Stock 1: 3416; Case/Package: SOT-23-5; Number of Pins: 5; Contact Plating: Tin,Matte; Min Operating Temperature: -40°C; Max Operating Temperature: 125°C; Bandwidth: 50kHz; Packaging: Tape and Reel; Package Quantity: 3000; Unity Gain Bandwidth Product: 50kHz; Number of Channels: 1; Number of Elements: 1; Number of Amplifiers: 1; Quiescent Current: 9uA; REACH SVHC: No SVHC; Lead Free: Contains Lead; ComponentLink1URL: https://datasheet.ciiva.com/22712/1610797-22712032.pdf?src-supplier=Element14; ComponentLink1Description: https://datasheet.ciiva.com/22712/1610797-22712032.pdf?src-supplier=Element14; ComponentLink2URL: https://datasheet.ciiva.com/23805/608874-23805844.pdf?src-supplier=Newark; ComponentLink2Description: https://datasheet.ciiva.com/23805/608874-23805844.pdf?src-supplier=Newark; ComponentLink3URL: https://datasheet.ciiva.com/1487/1610797-1487372.pdf?src-supplier=Element14; ComponentLink3Description: https://datasheet.ciiva.com/1487/1610797-1487372.pdf?src-supplier=Element14; Supplier Part Number 1: ADA4505-1ARJZ-R7CT-ND
U4-U7 = OP AMP DUAL: IC OPAMP VFB 50KHZ RRO 8MSOP; Manufacturer: Analog Devices; Manufacturer Part Number: ADA4505-2ARMZ; Common Mode Rejection Ratio: 105dB; Max Supply Voltage: 5V; Min Supply Voltage: 1.8V; Max Dual Supply Voltage: 2.5V; Min Dual Supply Voltage: 900mV; Voltage Gain: 120dB; Operating Supply Voltage: 3V; Slew Rate: 0.006V/µs; Input Offset Voltage (Vos): 3mV; Input Bias Current: 0.5pA; Operating Supply Current: 14uA; Number of Channels: 2; Power Supply Rejection Ratio (PSRR): 110dB; Output Current per Channel: 40mA; Quiescent Current: 7uA; Input Capacitance: 4.7pF; Supply Type: Single,Dual; Supplier 1: Digi-Key; RoHS: Yes; Category: Amplifiers - Op Amps, Buffer, Instrumentation; Stock 1: 767; Case/Package: MSOP; Number of Pins: 8; Contact Plating: Tin,Matte; Min Operating Temperature: -40°C; Max Operating Temperature: 125°C; Gain Bandwidth Product: 50kHz; Packaging: Rail/Tube; Package Quantity: 50; Unity Gain Bandwidth Product: 50kHz; Number of Circuits: 2; Number of Elements: 2; Number of Amplifiers: 2; Max Input Voltage: 5V; Nominal Supply Current: 7uA; Bandwidth: 50kHz; Length: 3.2mm; Width: 3.2mm; Height: 0.95mm; Lead Free: Contains Lead; REACH SVHC: No SVHC; ComponentLink1URL: https://datasheet.ciiva.com/24017/ada4505-1-4505-2-4505-4-249280-24017665.pdf?src-supplier=Mouser; ComponentLink1Description: https://datasheet.ciiva.com/24017/ada4505-1-4505-2-4505-4-249280-24017665.pdf?src-supplier=Mouser; ComponentLink2URL: https://datasheet.ciiva.com/2974/ada4505-1-4505-2-4505-4-2974772.pdf?src-supplier=Avnet; ComponentLink2Description: https://datasheet.ciiva.com/2974/ada4505-1-4505-2-4505-4-2974772.pdf?src-supplier=Avnet; ComponentLink3URL: https://datasheet.ciiva.com/17569/ada4505-1-4505-2-4505-4-17569270.pdf?src-supplier=Avnet+Europe; ComponentLink3Description: https://datasheet.ciiva.com/17569/ada4505-1-4505-2-4505-4-17569270.pdf?src-supplier=Avnet+Europe; ComponentLink4URL: https://datasheet.ciiva.com/1805/ada4505-1-4505-2-4505-4-1805784.pdf?src-supplier=Digi-Key; ComponentLink4Description: https://datasheet.ciiva.com/1805/ada4505-1-4505-2-4505-4-1805784.pdf?src-supplier=Digi-Key; Supplier Part Number 1: ADA4505-2ARMZ-ND

## Sheet Mainboard_Motordriver_Interface.SchDoc
size A4
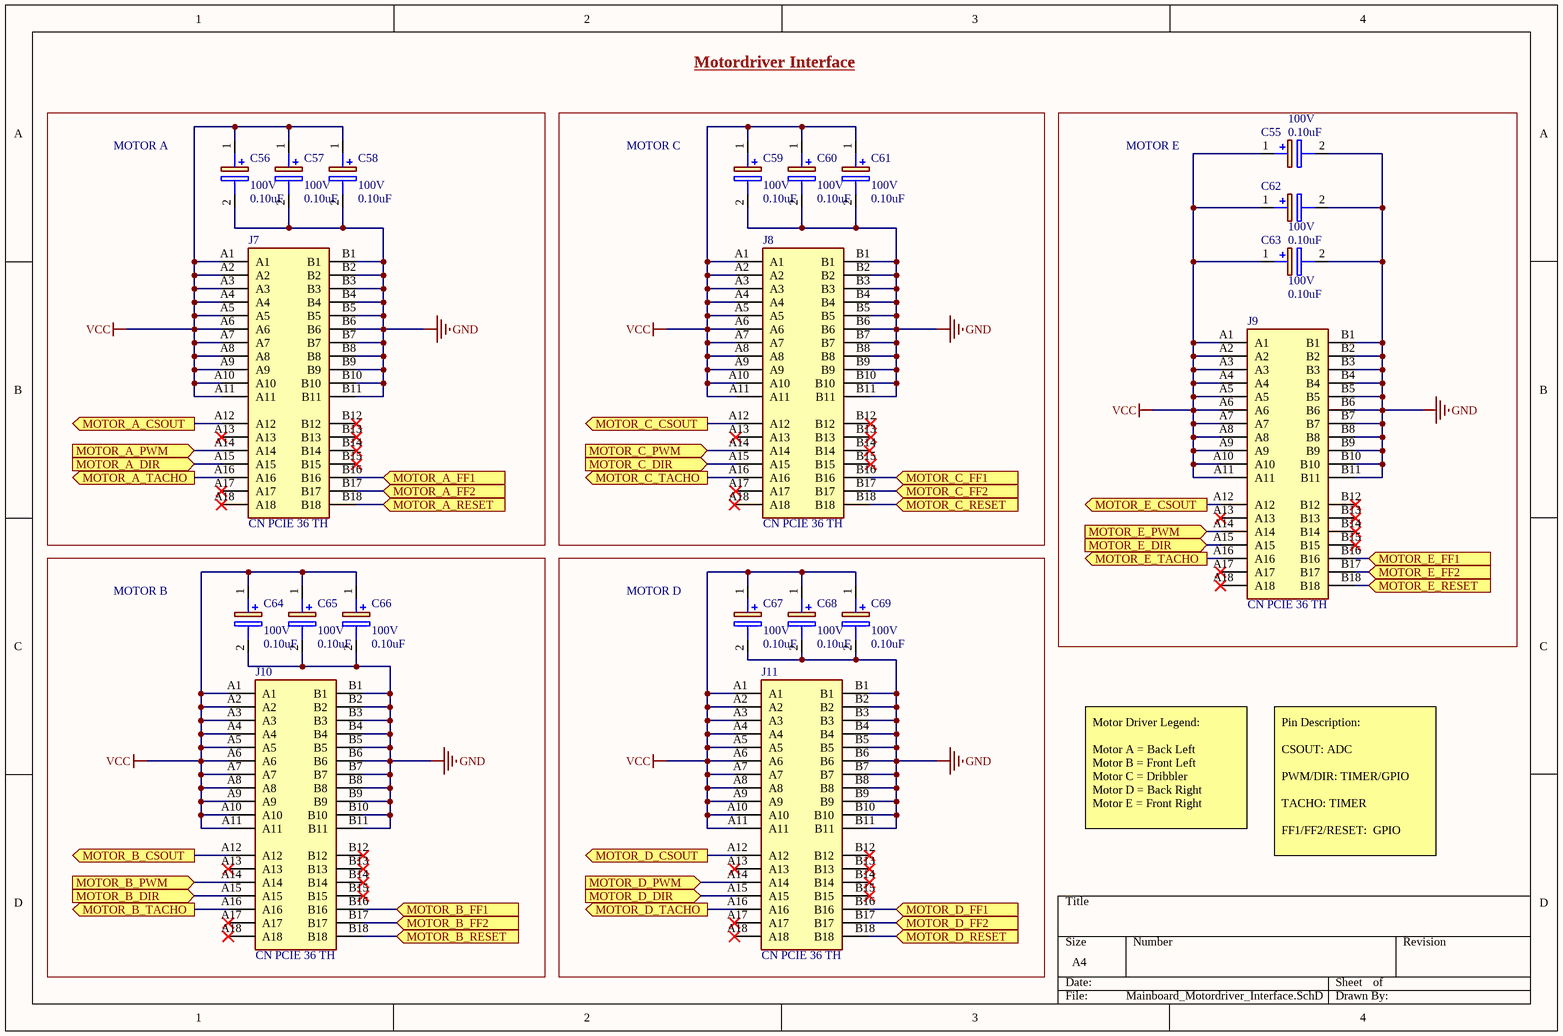
[diagram p2: Mainboard_Motordriver_Interface.SchDoc]

### Parts
C55  value 0.10uF  Rating: 100V  [CAPPRD200W50D525H1250]  (hidden comment: CAP POL 0.1uF 100V)
C56  value 0.10uF  Rating: 100V  [CAPPRD200W50D525H1250]  (hidden comment: CAP POL 0.1uF 100V)
C57  value 0.10uF  Rating: 100V  [CAPPRD200W50D525H1250]  (hidden comment: CAP POL 0.1uF 100V)
C58  value 0.10uF  Rating: 100V  [CAPPRD200W50D525H1250]  (hidden comment: CAP POL 0.1uF 100V)
C59  value 0.10uF  Rating: 100V  [CAPPRD200W50D525H1250]  (hidden comment: CAP POL 0.1uF 100V)
C60  value 0.10uF  Rating: 100V  [CAPPRD200W50D525H1250]  (hidden comment: CAP POL 0.1uF 100V)
C61  value 0.10uF  Rating: 100V  [CAPPRD200W50D525H1250]  (hidden comment: CAP POL 0.1uF 100V)
C62  value 0.10uF  Rating: 100V  [CAPPRD200W50D525H1250]  (hidden comment: CAP POL 0.1uF 100V)
C63  value 0.10uF  Rating: 100V  [CAPPRD200W50D525H1250]  (hidden comment: CAP POL 0.1uF 100V)
C64  value 0.10uF  Rating: 100V  [CAPPRD200W50D525H1250]  (hidden comment: CAP POL 0.1uF 100V)
C65  value 0.10uF  Rating: 100V  [CAPPRD200W50D525H1250]  (hidden comment: CAP POL 0.1uF 100V)
C66  value 0.10uF  Rating: 100V  [CAPPRD200W50D525H1250]  (hidden comment: CAP POL 0.1uF 100V)
C67  value 0.10uF  Rating: 100V  [CAPPRD200W50D525H1250]  (hidden comment: CAP POL 0.1uF 100V)
C68  value 0.10uF  Rating: 100V  [CAPPRD200W50D525H1250]  (hidden comment: CAP POL 0.1uF 100V)
C69  value 0.10uF  Rating: 100V  [CAPPRD200W50D525H1250]  (hidden comment: CAP POL 0.1uF 100V)
J7  CN PCIE 36 TH  [CN PCIE 36 TH]
J8  CN PCIE 36 TH  [CN PCIE 36 TH]
J9  CN PCIE 36 TH  [CN PCIE 36 TH]
J10  CN PCIE 36 TH  [CN PCIE 36 TH]
J11  CN PCIE 36 TH  [CN PCIE 36 TH]

### Blocks framed on the sheet
MOTOR A: C56-C58 J7
MOTOR C: C59-C61 J8
MOTOR E: C55 C62 C63 J9
MOTOR B: C64-C66 J10
MOTOR D: C67-C69 J11

### Ports
MOTOR_A_CSOUT (out), MOTOR_A_DIR (in), MOTOR_A_FF1 (in), MOTOR_A_FF2 (in), MOTOR_A_PWM (in), MOTOR_A_RESET (in), MOTOR_A_TACHO (out), MOTOR_B_CSOUT (out), MOTOR_B_DIR (in), MOTOR_B_FF1 (in), MOTOR_B_FF2 (in), MOTOR_B_PWM (in), MOTOR_B_RESET (in), MOTOR_B_TACHO (out), MOTOR_C_CSOUT (out), MOTOR_C_DIR (in), MOTOR_C_FF1 (in), MOTOR_C_FF2 (in), MOTOR_C_PWM (in), MOTOR_C_RESET (in), MOTOR_C_TACHO (out), MOTOR_D_CSOUT (out), MOTOR_D_DIR (in), MOTOR_D_FF1 (in), MOTOR_D_FF2 (in), MOTOR_D_PWM (in), MOTOR_D_RESET (in), MOTOR_D_TACHO (out), MOTOR_E_CSOUT (out), MOTOR_E_DIR (in), MOTOR_E_FF1 (in), MOTOR_E_FF2 (in), MOTOR_E_PWM (in), MOTOR_E_RESET (in), MOTOR_E_TACHO (out)

### Nets
GND: C55.2(-) C56.2(-) C57.2(-) C58.2(-) C59.2(-) C60.2(-) C61.2(-) C62.2(-) C63.2(-) C64.2(-) C65.2(-) C66.2(-) C67.2(-) C68.2(-) C69.2(-) J7.B1 J7.B2 J7.B3 J7.B4 J7.B5 J7.B6 J7.B7 J7.B8 J7.B9 J7.B10 J7.B11 J8.B1 J8.B2 J8.B3 J8.B4 J8.B5 J8.B6 J8.B7 J8.B8 J8.B9 J8.B10 J8.B11 J9.B1 J9.B2 J9.B3 J9.B4 J9.B5 J9.B6 J9.B7 J9.B8 J9.B9 J9.B10 J9.B11 J10.B1 J10.B2 J10.B3 J10.B4 J10.B5 J10.B6 J10.B7 J10.B8 J10.B9 J10.B10 J10.B11 J11.B1 J11.B2 J11.B3 J11.B4 J11.B5 J11.B6 J11.B7 J11.B8 J11.B9 J11.B10 J11.B11
VCC: C55.1(+) C56.1(+) C57.1(+) C58.1(+) C59.1(+) C60.1(+) C61.1(+) C62.1(+) C63.1(+) C64.1(+) C65.1(+) C66.1(+) C67.1(+) C68.1(+) C69.1(+) J7.A1 J7.A2 J7.A3 J7.A4 J7.A5 J7.A6 J7.A7 J7.A8 J7.A9 J7.A10 J7.A11 J8.A1 J8.A2 J8.A3 J8.A4 J8.A5 J8.A6 J8.A7 J8.A8 J8.A9 J8.A10 J8.A11 J9.A1 J9.A2 J9.A3 J9.A4 J9.A5 J9.A6 J9.A7 J9.A8 J9.A9 J9.A10 J9.A11 J10.A1 J10.A2 J10.A3 J10.A4 J10.A5 J10.A6 J10.A7 J10.A8 J10.A9 J10.A10 J10.A11 J11.A1 J11.A2 J11.A3 J11.A4 J11.A5 J11.A6 J11.A7 J11.A8 J11.A9 J11.A10 J11.A11
NetJ7_A12: J7.A12 ; port MOTOR_A_CSOUT
NetJ7_A14: J7.A14 ; port MOTOR_A_PWM
NetJ7_A15: J7.A15 ; port MOTOR_A_DIR
NetJ7_A16: J7.A16 ; port MOTOR_A_TACHO
NetJ7_B16: J7.B16 ; port MOTOR_A_FF1
NetJ7_B17: J7.B17 ; port MOTOR_A_FF2
NetJ7_B18: J7.B18 ; port MOTOR_A_RESET
NetJ8_A12: J8.A12 ; port MOTOR_C_CSOUT
NetJ8_A14: J8.A14 ; port MOTOR_C_PWM
NetJ8_A15: J8.A15 ; port MOTOR_C_DIR
NetJ8_A16: J8.A16 ; port MOTOR_C_TACHO
NetJ8_B16: J8.B16 ; port MOTOR_C_FF1
NetJ8_B17: J8.B17 ; port MOTOR_C_FF2
NetJ8_B18: J8.B18 ; port MOTOR_C_RESET
NetJ9_A12: J9.A12 ; port MOTOR_E_CSOUT
NetJ9_A14: J9.A14 ; port MOTOR_E_PWM
NetJ9_A15: J9.A15 ; port MOTOR_E_DIR
NetJ9_A16: J9.A16 ; port MOTOR_E_TACHO
NetJ9_B16: J9.B16 ; port MOTOR_E_FF1
NetJ9_B17: J9.B17 ; port MOTOR_E_FF2
NetJ9_B18: J9.B18 ; port MOTOR_E_RESET
NetJ10_A12: J10.A12 ; port MOTOR_B_CSOUT
NetJ10_A14: J10.A14 ; port MOTOR_B_PWM
NetJ10_A15: J10.A15 ; port MOTOR_B_DIR
NetJ10_A16: J10.A16 ; port MOTOR_B_TACHO
NetJ10_B16: J10.B16 ; port MOTOR_B_FF1
NetJ10_B17: J10.B17 ; port MOTOR_B_FF2
NetJ10_B18: J10.B18 ; port MOTOR_B_RESET
NetJ11_A12: J11.A12 ; port MOTOR_D_CSOUT
NetJ11_A14: J11.A14 ; port MOTOR_D_PWM
NetJ11_A15: J11.A15 ; port MOTOR_D_DIR
NetJ11_A16: J11.A16 ; port MOTOR_D_TACHO
NetJ11_B16: J11.B16 ; port MOTOR_D_FF1
NetJ11_B17: J11.B17 ; port MOTOR_D_FF2
NetJ11_B18: J11.B18 ; port MOTOR_D_RESET

Not connected (* = marked no-connect by the designer): J7 A13* A17* A18* B12* B13* B14* B15*; J8 A13* A17* A18 B12* B13* B14 B15*; J9 A13* A17* A18* B12* B13* B14* B15*; J10 A13* A17* A18* B12* B13* B14* B15*; J11 A13* A17* A18* B12* B13* B14* B15*

### Notes on the sheet
- Motordriver Interface
- Motor Driver Legend:
  Motor A = Back Left
  Motor B = Front Left
  Motor C = Dribbler
  Motor D = Back Right
  Motor E = Front Right
- Pin Description:
  CSOUT: ADC
  PWM/DIR: TIMER/GPIO
  TACHO: TIMER
  FF1/FF2/RESET:  GPIO

### Library data of the parts
C55-C69 = CAP POL 0.1uF 100V: 0.1µF 100V Aluminum Electrolytic Capacitors, Through-Hole, Radial, Can 2000 Hrs @ 85°C; Manufacturer_Name: Nichicon; Manufacturer_Part_Number: UKL2A0R1KDD; Datasheet Link: http://www.mouser.com/ds/2/293/e-ukl-876305.pdf; Height: 12.5mm; Mouser Part Number: 647-UKL2A0R1KDD; Mouser Price/Stock: https://www.mouser.com/Search/Refine.aspx?Keyword=647-UKL2A0R1KDD; Supplier 1: Digi-Key; Supplier Part Number 1: 493-16876-ND
J7-J11 = CN PCIE 36 TH: 36 Position Female Connector PCI Expressâ„¢ Gold 0.039 _1.00mm_ Black 10018784-10210TLF; MF: Amphenol ICC; Price: None; SnapEDA_Link: https://www.snapeda.com/parts/10018784-10210TLF/Amphenol%20FCI/view-part/520950/?ref=snap; Availability: Unavailable; MP: 10018784-10210TLF; Package: None; Value: *

## Sheet Mainboard_Power_Interface.SchDoc
size A4
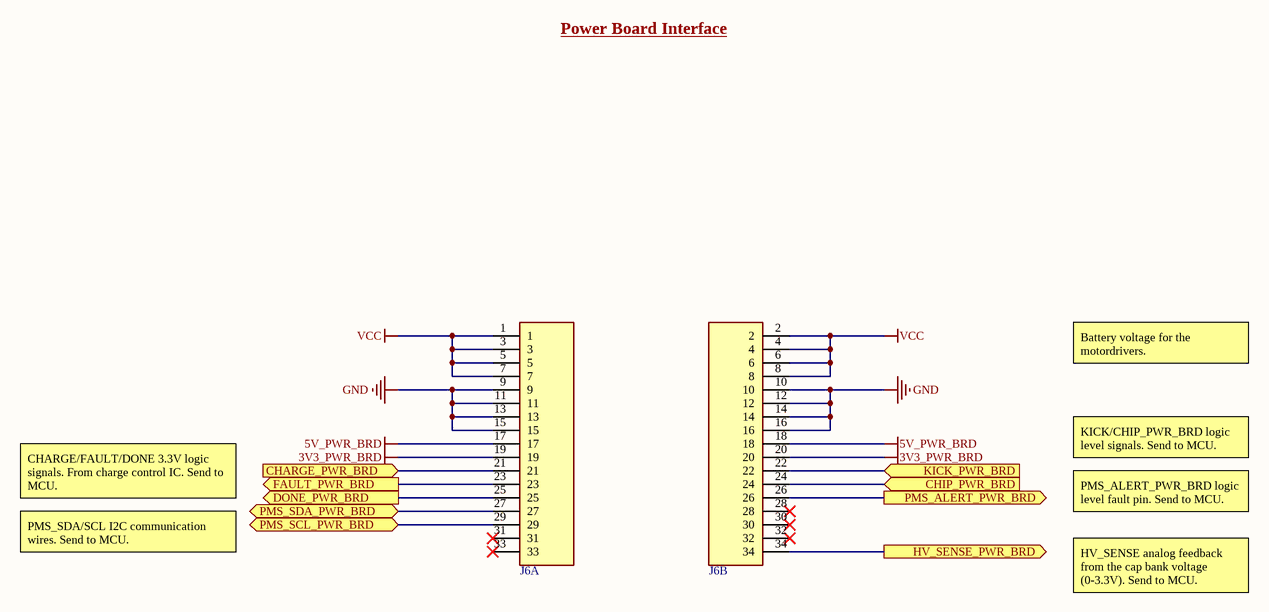
[diagram p3: Mainboard_Power_Interface.SchDoc]

### Parts
J6  0.1" Header Female 34  [SAMTEC-SSM-117-X-DV]  (value not drawn)  (parts A,B of 2)

### Ports
CHARGE_PWR_BRD (in), CHIP_PWR_BRD (in), DONE_PWR_BRD (out), FAULT_PWR_BRD (out), HV_SENSE_PWR_BRD (out), KICK_PWR_BRD (in), PMS_ALERT_PWR_BRD (out), PMS_SCL_PWR_BRD (bidir), PMS_SDA_PWR_BRD (bidir)

### Nets
3V3_PWR_BRD: J6.19 J6.20
5V_PWR_BRD: J6.17 J6.18
GND: J6.9 J6.10 J6.11 J6.12 J6.13 J6.14 J6.15 J6.16
VCC: J6.1 J6.2 J6.3 J6.4 J6.5 J6.6 J6.7 J6.8
NetJ6_21: J6.21 ; port CHARGE_PWR_BRD
NetJ6_22: J6.22 ; port KICK_PWR_BRD
NetJ6_23: J6.23 ; port FAULT_PWR_BRD
NetJ6_24: J6.24 ; port CHIP_PWR_BRD
NetJ6_25: J6.25 ; port DONE_PWR_BRD
NetJ6_26: J6.26 ; port PMS_ALERT_PWR_BRD
NetJ6_27: J6.27 ; port PMS_SDA_PWR_BRD
NetJ6_29: J6.29 ; port PMS_SCL_PWR_BRD
NetJ6_34: J6.34 ; port HV_SENSE_PWR_BRD

Not connected (* = marked no-connect by the designer): J6 28* 30* 31* 32* 33*

### Notes on the sheet
- Power Board Interface
- Battery voltage for the motordrivers.
- KICK/CHIP_PWR_BRD logic level signals. Send to MCU.
- CHARGE/FAULT/DONE 3.3V logic signals. From charge control IC. Send to MCU.
- PMS_ALERT_PWR_BRD logic level fault pin. Send to MCU.
- PMS_SDA/SCL I2C communication wires. Send to MCU.
- HV_SENSE analog feedback from the cap bank voltage (0-3.3V). Send to MCU.

### Library data of the parts
J6 = CN HDR 34POS 2x17: Female Header THRU 34POS 2ROW 0.1" (2.54mm) pitch

## Sheet Mainboard_RMII_Interface.SchDoc
size A4
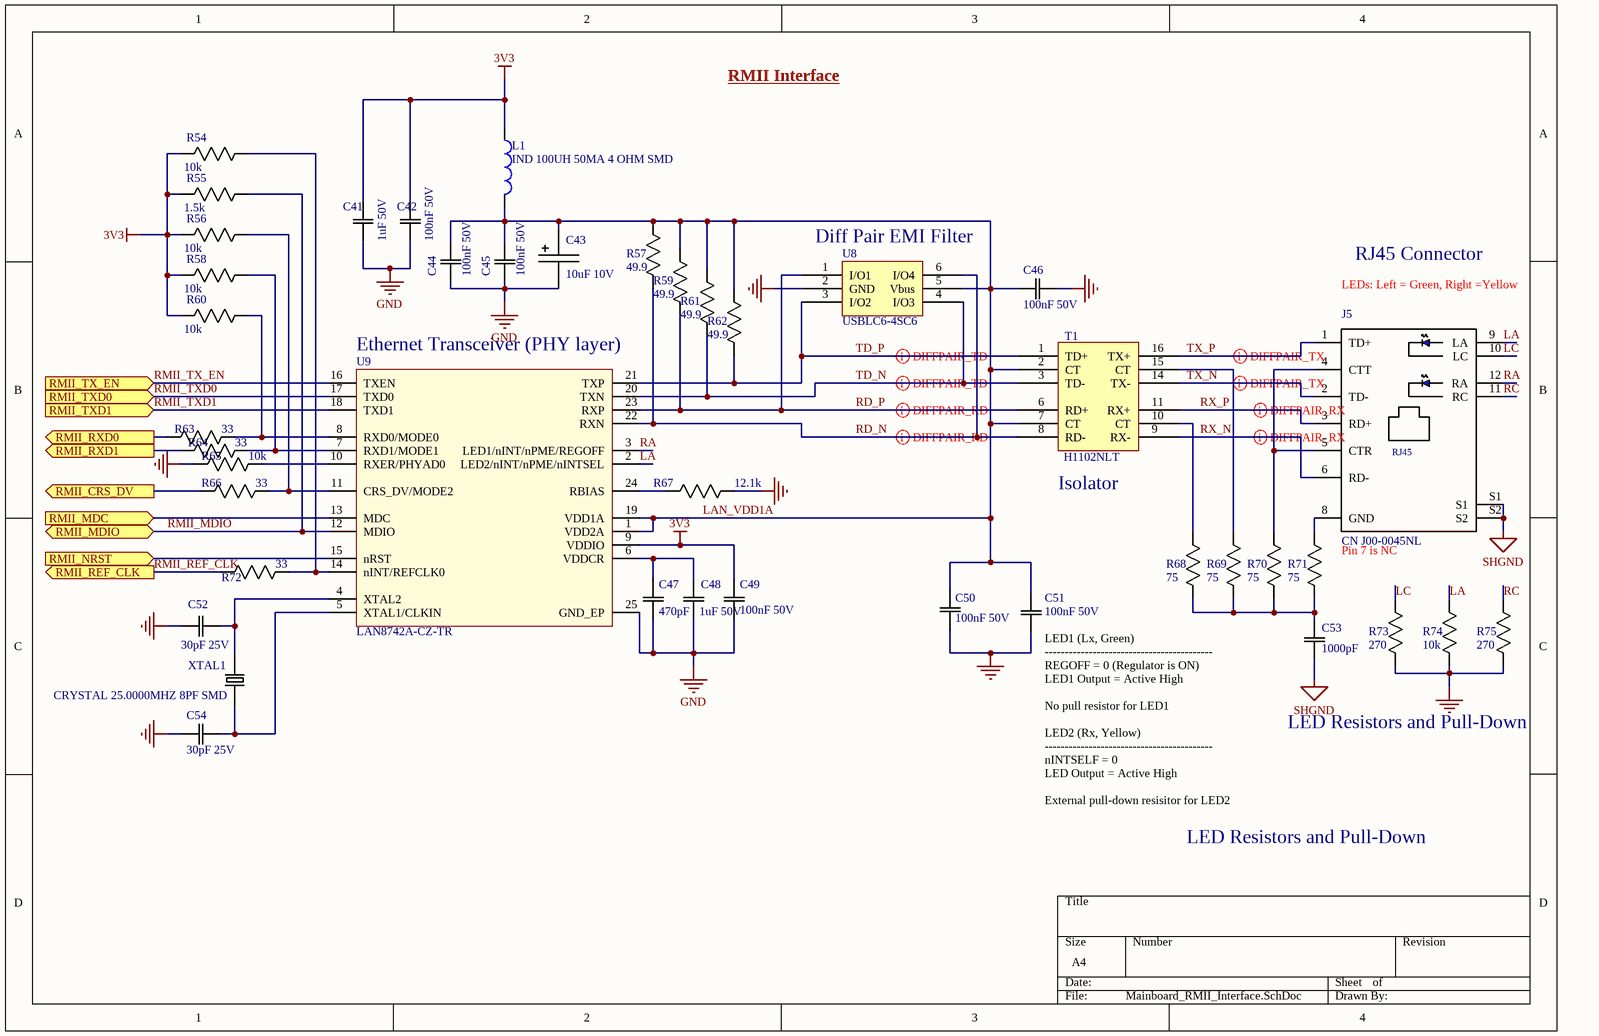
[diagram p4: Mainboard_RMII_Interface.SchDoc]

### Parts
C41  1uF 50V  [0805]
C42  100nF 50V  [0805]
C43  10uF 10V  [1206 Polarized]
C44  100nF 50V  [0805]
C45  100nF 50V  [0805]
C46  100nF 50V  [0805]
C47  470pF  [0805]
C48  1uF 50V  [0805]
C49  100nF 50V  [0805]
C50  100nF 50V  [0805]
C51  100nF 50V  [0805]
C52  30pF 25V  [0805]
C53  1000pF  [0805]
C54  30pF 25V  [0805]
J5  CN J00-0045NL  [RJ45 J00-0045NL]
L1  IND 100UH 50MA 4 OHM SMD  [0805]
R54  10k  [0805]
R55  1.5k  [0805]
R56  10k  [0805]
R57  49.9  [0805]
R58  10k  [0805]
R59  49.9  [0805]
R60  10k  [0805]
R61  49.9  [0805]
R62  49.9  [0805]
R63  33  [0805]
R64  33  [0805]
R65  10k  [0805]
R66  33  [0805]
R67  12.1k  [0805]
R68  75  [0805]
R69  75  [0805]
R70  75  [0805]
R71  75  [0805]
R72  33  [0805]
R73  270  [0805]
R74  10k  [0805]
R75  270  [0805]
T1  H1102NLT  [TRANSFORMER]
U8  USBLC6-4SC6  [SOT23-6L]
U9  LAN8742A-CZ-TR  [24-QFN (4x4)]
XTAL1  CRYSTAL 25.0000MHZ 8PF SMD  [SMD-2]

### Ports
RMII_CRS_DV (out), RMII_MDC (in), RMII_MDIO (bidir), RMII_NRST (in), RMII_REF_CLK (out), RMII_RXD0 (out), RMII_RXD1 (out), RMII_TX_EN (in), RMII_TXD0 (in), RMII_TXD1 (in)

### Nets
3V3: C41.2(C2) C42.2(C2) C49.2(C2) L1.1 R54.2(R2) R55.2(R2) R56.2(R2) R58.2(R2) R60.2(R2) U9.9(VDDIO)
GND: C41.1(C1) C42.1(C1) C43.2(P$2) C44.1(C1) C45.1(C1) C46.2(C2) C47.1(C1) C48.1(C1) C49.1(C1) C50.1(C1) C51.1(C1) C52.1(C1) C54.1(C1) R65.2(R2) R67.1(R1) R73.2(R2) R74.2(R2) R75.2(R2) U8.2(GND) U9.25(GND_EP)
SHGND: C53.1(C1) J5.S1 J5.S2
LA: J5.9(LA) R74.1(R1) U9.2(LED2/nINT/nPME/nINTSEL)
LAN_VDD1A: C43.1(P$1) C44.2(C2) C45.2(C2) C46.1(C1) C50.2(C2) C51.2(C2) L1.2 R57.1(R1) R59.1(R1) R61.1(R1) R62.1(R1) T1.2(CT) T1.7(CT) U8.5(Vbus) U9.1(VDD2A) U9.19(VDD1A)
LC: J5.10(LC) R73.1(R1)
RA: J5.12(RA) U9.3(LED1/nINT/nPME/REGOFF)
RC: J5.11(RC) R75.1(R1)
RD_N: R57.2(R2) T1.8(RD-) U8.6(I/O4) U9.22(RXN)
RD_P: R59.2(R2) T1.6(RD+) U8.1(I/O1) U9.23(RXP)
RMII_MDIO: R55.1(R1) U9.12(MDIO) ; port RMII_MDIO
RMII_REF_CLK: R72.2(R2) ; port RMII_REF_CLK
RMII_TX_EN: U9.16(TXEN) ; port RMII_TX_EN
RMII_TXD0: U9.17(TXD0) ; port RMII_TXD0
RMII_TXD1: U9.18(TXD1) ; port RMII_TXD1
RX_N: J5.6(RD-) T1.9(RX-)
RX_P: J5.3(RD+) T1.11(RX+)
TD_N: R61.2(R2) T1.3(TD-) U8.4(I/O3) U9.20(TXN)
TD_P: R62.2(R2) T1.1(TD+) U8.3(I/O2) U9.21(TXP)
TX_N: J5.2(TD-) T1.14(TX-)
TX_P: J5.1(TD+) T1.16(TX+)
NetC47_2: C47.2(C2) C48.2(C2) U9.6(VDDCR)
NetC52_2: C52.2(C2) U9.4(XTAL2) XTAL1.2
NetC53_2: C53.2(C2) R68.2(R2) R69.2(R2) R70.2(R2) R71.2(R2)
NetC54_2: C54.2(C2) U9.5(XTAL1/CLKIN) XTAL1.1
NetC70_2: U9.15(nRST) ; port RMII_NRST
NetJ5_4: J5.4(CTT) J5.5(CTR) R70.1(R1)
NetJ5_8: J5.8(GND) R71.1(R1)
NetR54_1: R54.1(R1) R72.1(R1) U9.14(nINT/REFCLK0)
NetR56_1: R56.1(R1) R66.1(R1) U9.11(CRS_DV/MODE2)
NetR58_1: R58.1(R1) R64.1(R1) U9.7(RXD1/MODE1)
NetR60_1: R60.1(R1) R63.1(R1) U9.8(RXD0/MODE0)
NetR63_2: R63.2(R2) ; port RMII_RXD0
NetR64_2: R64.2(R2) ; port RMII_RXD1
NetR65_1: R65.1(R1) U9.10(RXER/PHYAD0)
NetR66_2: R66.2(R2) ; port RMII_CRS_DV
NetR67_2: R67.2(R2) U9.24(RBIAS)
NetR68_1: R68.1(R1) T1.10(CT)
NetR69_1: R69.1(R1) T1.15(CT)
NetU9_13: U9.13(MDC) ; port RMII_MDC

### Layout directives
differential pair: RD_N, RD_P, RX_N, RX_P, TD_N, TD_P, TX_N, TX_P

### Notes on the sheet
- RMII Interface
- (near U8) Diff Pair EMI Filter
- (near J5) LEDs: Left = Green, Right =Yellow
- RJ45 Connector
- Ethernet Transceiver (PHY layer)
- (near T1) Isolator
- Pin 7 is NC
- LED Resistors and Pull-Down
- (near C51) LED1 (Lx, Green)
  ------------------------------------------
  REGOFF = 0 (Regulator is ON)
  LED1 Output = Active High
  No pull resistor for LED1
  LED2 (Rx, Yellow)
  ------------------------------------------
  nINTSELF = 0
  LED Output = Active High
  External pull-down resisitor for LED2
- (in symbol CN MAGJACK) RJ45

### Library data of the parts
C41 C48 = CAP 1uF 50V: CAP CER 1UF 50V X7R 0805; Tolerance: 10%; Package: 0805; Value: 1uF; Rating: 50V; Temperature Coefficient: X7R; Operating Temperature: -55°C ~ 125°C
C42 C44-C46 C49-C51 = CAP 100nF 50V: as C27 on sheet Mainboard_Encoder_Interface; Package: 0805; Value: 100nF; Rating: 50V
C43 = CAP TANT 10uF 10V: CAP TANT 10UF 10V 1206; Tolerance: 10%; ESR (Equivalent Series Resistance): 3.8 Ohm; Type: Molded Tantalum; Package: 1206; Value: 10uF; Rating: 10V; Operating Temperature: -55°C ~ 125°C
C47 = CAP 470pF 50V: CAP CER 470PF 50V X7R 0603/0805; Tolerance: 10%; Package: 0603/0805; Value: 470pF; Rating: 50V; Temperature Coefficient: X7R; Operating Temperature: -55°C ~ 125°C
C52 C54 = CAP 30pF 25V: CAP CER 30PF 25V NP0 0805; Tolerance: 20%; Package: 0805; Value: 30pF; Rating: 25V
C53 = CAP 1000pF 50V: CAP CER 1000PF 50V X7R 0603/0805; Tolerance: 10%; Package: 0603/0805; Value: 1000pF; Rating: 50V; Temperature Coefficient: X7R; Operating Temperature: -55°C ~ 125°C
J5 = CN MAGJACK: CN MAGJACK 1PORT 100 BASE-TX; MF: Pulse Electronics; Package: None; SnapEDA_Link: https://www.snapeda.com/parts/J00-0045NL/Pulse%20Electronics%20Network/view-part/87956/?ref=snap; MP: J00-0045NL; Value: *; Digikey Link: https://www.digikey.com/product-detail/en/pulse-electronics-network/J00-0045NL/553-1619-5-ND/1036860?utm_source=snapeda&utm_medium=aggregator&utm_campaign=symbol; Digikey: 553-1619-5-ND; Supplier 1: Mouser; Supplier Part Number 1: 673-J00-0045NL
L1 = IND 100UH 50MA 4 OHM SMD: 100µH Unshielded Wirewound Inductor 50mA 4Ohm 0805 (2012 Metric); MF: Taiyo Yuden; MP: LBR2012T101K; Revision: July-2002: Re-released for DXP Platform.; Value: 100uH; Digikey: 587-2048-1-ND; Digikey Link: https://www.digikey.ca/product-detail/en/taiyo-yuden/LBR2012T101K/587-2048-1-ND/1788995; Supplier 1: Digi-Key; Supplier Part Number 1: 587-4040-1-ND
R54 R56 R58 R60 R65 R74 = RES 10k 1/8W - 1%: RES SMD 10K OHM 1% 1/8W 0805; Power (Watts): 0.125W; Package: 0805; Value: 10k; Tolerance: 1%
R55 = RES 1.5k 1/8W - 1%: RES SMD 1.5K OHM 1% 1/8W 0805; Power (Watts): 0.125W; Package: 0805; Value: 1.5k; Tolerance: 1%; ComponentLink1Description: digikey; ComponentLink1URL: https://www.digikey.ca/en/products/detail/panasonic-electronic-components/ERJ-6ENF1022V/111476
R57 R59 R61 R62 = RES 49.9 1/8W: RES SMD 49.9 OHM 1% 1/8W 0805; Power (Watts): 0.125W; Package: 0805; Value: 49.9; Tolerance: 1%
R63 R64 R66 R72 = RES 33.0 1/8W - 1%: RES SMD 33 OHM 1% 1/8W 0805; Power (Watts): 0.125W; Package: 0805; Value: 33; Tolerance: 1%
R67 = RES 12.1k 1/8W: RES SMD 12.1K OHM 1% 1/8W 0805; Power (Watts): 0.125W; Package: 0805; Value: 12.1k; Tolerance: 1%
R68-R71 = RES 75.0 1/8W - 1%: RES SMD 75 OHM 1% 1/8W 0805; Power (Watts): 0.125W; Package: 0805; Value: 75; Tolerance: 1%
R73 R75 = RES 270.0 1/8W: RES SMD 270 OHM 5% 1/8W 0805; Power (Watts): 0.125W; Package: 0805; Value: 270; Tolerance: 5%
T1 = XFRMR H1102NLT: Isolation and Data Interface (Encapsulated) Pulse Transformer 1:1 Transmitter, 1:1 Receiver Surface Mount; MF: Pulse Electronics; Package: SOIC-16; Price: 7.99 CAD; MP: H1102NL; Digikey: 553-1323-5-ND; Digikey Link: https://www.digikey.ca/en/products/detail/pulse-electronics-network/H1102NL/1036940?s=N4IgTCBcDaIBIEYEAYwDkAyIC6BfIA; Supplier 1: Digi-Key; Supplier Part Number 1: 553-1323-5-ND
U9 = LAN8742A-CZ-TR: LAN8742A-CZ-TR - Small Footprint RMII 10/100 Ethernet, Transceiver with HP Auto-MDIX and flexPWR Technology SQFN-24; MF: Microchip Technology; MP: LAN8742A-CZ-TR; Digikey: LAN8742A-CZ-CT-ND; Digikey Link: https://www.digikey.ca/product-detail/en/microchip-technology/LAN8742A-CZ-TR/LAN8742A-CZ-CT-ND/8256089; Supplier 1: Digi-Key; Supplier Part Number 1: LAN8742A-CZ-CT-ND
XTAL1 = XTAL 25MHZ 8PF SMD: 25MHz ±50ppm Crystal 8pF 70 Ohms 2-SMD, No Lead; MP: NX5032GA-25.000000MHZ-LN-CD-1; MF: NDK America, Inc.; ESR: 70 Ohms; Package: 2-SMD, No Lead; Price: 0.95 CAD; Frequency: 25MHz; Digikey: 644-1041-1-ND; Digikey Link: https://www.digikey.ca/product-detail/en/ndk-america-inc/NX5032GA-25.000000MHZ-LN-CD-1/644-1041-1-ND/1128913; Load Capacitance: 8pF; Supplier 1: Digi-Key; Supplier Part Number 1: 644-1041-1-ND

## Sheet Mainboard_Wifi_Interface.SchDoc
size A4
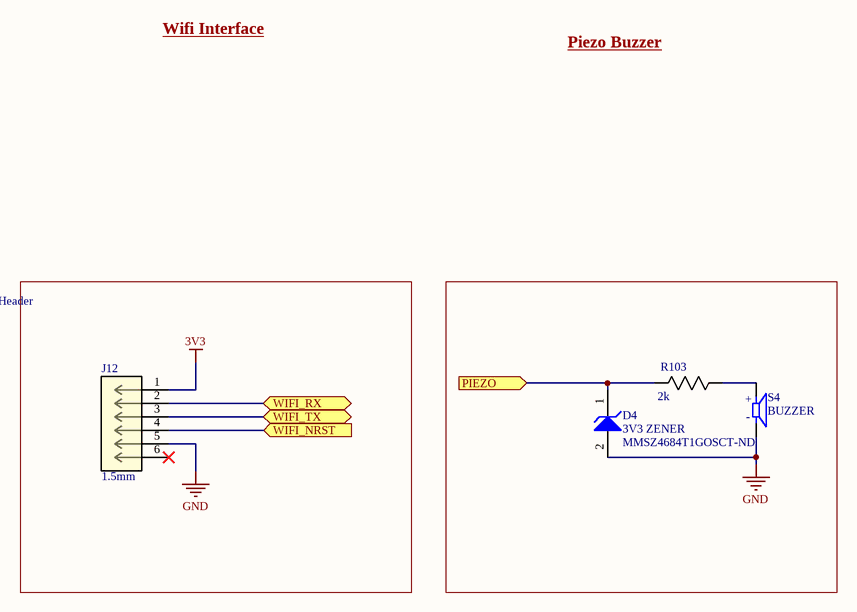
[diagram p5: Mainboard_Wifi_Interface.SchDoc]

### Parts
D4  3V3 ZENER  Supplier Part Number 1: MMSZ4684T1GOSCT-ND  [ONSC-SOD-123-2-425-04_V]
J12  1.5mm  [6POS JST]
R103  2k  [0805]
S4  BUZZER  [PKM13EPYH4000-A0]

### Blocks framed on the sheet
Wifi Interface Header: J12

### Ports
PIEZO (in), WIFI_NRST (in), WIFI_RX (bidir), WIFI_TX (bidir)

### Nets
3V3: J12.1
GND: D4.2(A) J12.5 S4.N
NetC70_2: J12.4 ; port WIFI_NRST
NetD4_1: D4.1(K) R103.2(R2) ; port PIEZO
NetJ12_2: J12.2 ; port WIFI_RX
NetJ12_3: J12.3 ; port WIFI_TX
NetR103_1: R103.1(R1) S4.P

Not connected (* = marked no-connect by the designer): J12 6*

### Notes on the sheet
- Wifi Interface
- Piezo Buzzer
- (in symbol BUZZER PKM13EPYH4000-A0) +; -

### Library data of the parts
D4 = DIODE ZENER 3.3 500mW: Zener 3V3 Voltage Regulator, 500 mW, 2-Pin SOD-123, Pb-Free, Tape and Reel; PartNumber: MMSZ4684T1G; Manufacturer: On Semiconductor; P Max (W): 0.5; VZ Typ (V): 3.3; ComponentLink2URL: http://www.onsemi.com/pub_link/Collateral/MMSZ4678T1-D.PDF; ComponentLink1URL: http://www.onsemi.com/; ComponentLink2Description: Datasheet; ComponentLink3URL: http://www.onsemi.com/pub_link/Collateral/425-04.PDF; DatasheetVersion: Rev. 9; ComponentLink1Description: Manufacturer URL; RoHS: Pb-Free; ComponentLink3Description: Package Specification; PackageReference: SOD-123-2-425-04; PackageVersion: Rev. G, 10/2009; Mounting Technology: Surface Mount; Packing: Tape and Reel; PackageDescription: 2-Pin SOD, Body 1.6 x 2.69 mm; Supplier 1: Digi-Key
J12 = CN 6POS JST RA: as J1 on sheet Mainboard_Encoder_Interface; Supplier 1: Digi-Key; RoHS: Yes; Category: Headers and Wire Housings; Stock 1: 14808; Mount: Through Hole; Number of Pins: 6; Color: White; Contact Plating: Tin,Copper; Contact Material: Brass,Tin,Copper; Housing Color: Beige; Housing Material: Polyamide; Material: Nylon; Contact Shape: Circular; Insulation Material: Nylon; Insulation Color: Natural; Min Operating Temperature: -25°C; Max Operating Temperature: 85°C; Number of Rows: 1; Packaging: Bulk; Termination: Solder; Fastening Type: Detent; Number of Contacts: 6; Max Voltage Rating (AC): 50V; Max Current Rating: 1A; Orientation: Right Angle; Voltage Rating (AC): 50V; Voltage Rating (DC): 50V; Length: 10.5mm; Width: 3.5mm; Height: 7.2mm; Pitch: 1.5mm; Depth: 6mm; Lead Pitch: 1.5mm; Contact Mating Length: 0.094inch; Lead Free: Lead Free; Flammability Rating: UL94 V-0; REACH SVHC: No SVHC; ComponentLink1URL: https://datasheet.ciiva.com/8052/80556-8052225.pdf?src-supplier=Element14; ComponentLink1Description: https://datasheet.ciiva.com/8052/80556-8052225.pdf?src-supplier=Element14; ComponentLink2URL: https://datasheet.ciiva.com/25617/0900766b81147f94-25617345.pdf?src-supplier=RSComponents; ComponentLink2Description: https://datasheet.ciiva.com/25617/0900766b81147f94-25617345.pdf?src-supplier=RSComponents; ComponentLink3URL: https://datasheet.ciiva.com/11752/0900766b8082f593-11752194.pdf?src-supplier=RSComponents; ComponentLink3Description: https://datasheet.ciiva.com/11752/0900766b8082f593-11752194.pdf?src-supplier=RSComponents; ComponentLink4URL: https://datasheet.ciiva.com/26894/getdatasheetpartid-642095-26894637.pdf?src-supplier=Verical; ComponentLink4Description: https://datasheet.ciiva.com/26894/getdatasheetpartid-642095-26894637.pdf?src-supplier=Verical; ComponentLink5URL: https://datasheet.ciiva.com/712/ezh-712560.pdf?src-supplier=Digi-Key; ComponentLink5Description: https://datasheet.ciiva.com/712/ezh-712560.pdf?src-supplier=Digi-Key; ComponentLink6URL: https://datasheet.ciiva.com/16484/s6b-zrlfsn-16484554.pdf?src-supplier=Future+Electronics; ComponentLink6Description: https://datasheet.ciiva.com/16484/s6b-zrlfsn-16484554.pdf?src-supplier=Future+Electronics; Supplier Part Number 1: 455-1673-ND
R103 = RES 2k 1/8W: RES SMD 2K OHM 5% 1/8W 0805; Power (Watts): 0.125W; Package: 0805; Value: 2k; Tolerance: 5%
S4 = BUZZER PKM13EPYH4000-A0: Max Voltage: 30V; Decibels: 70dB @ 1.5V, 10cm; Rated Voltage: 1.5V; Supplier: Digikey; Supplier Part Number: 490-4698-1-ND; Part Name: BUZZER PKM13EPYH4000-A0